# Altium project Gebru.PrjPcb (part 1 of 2)
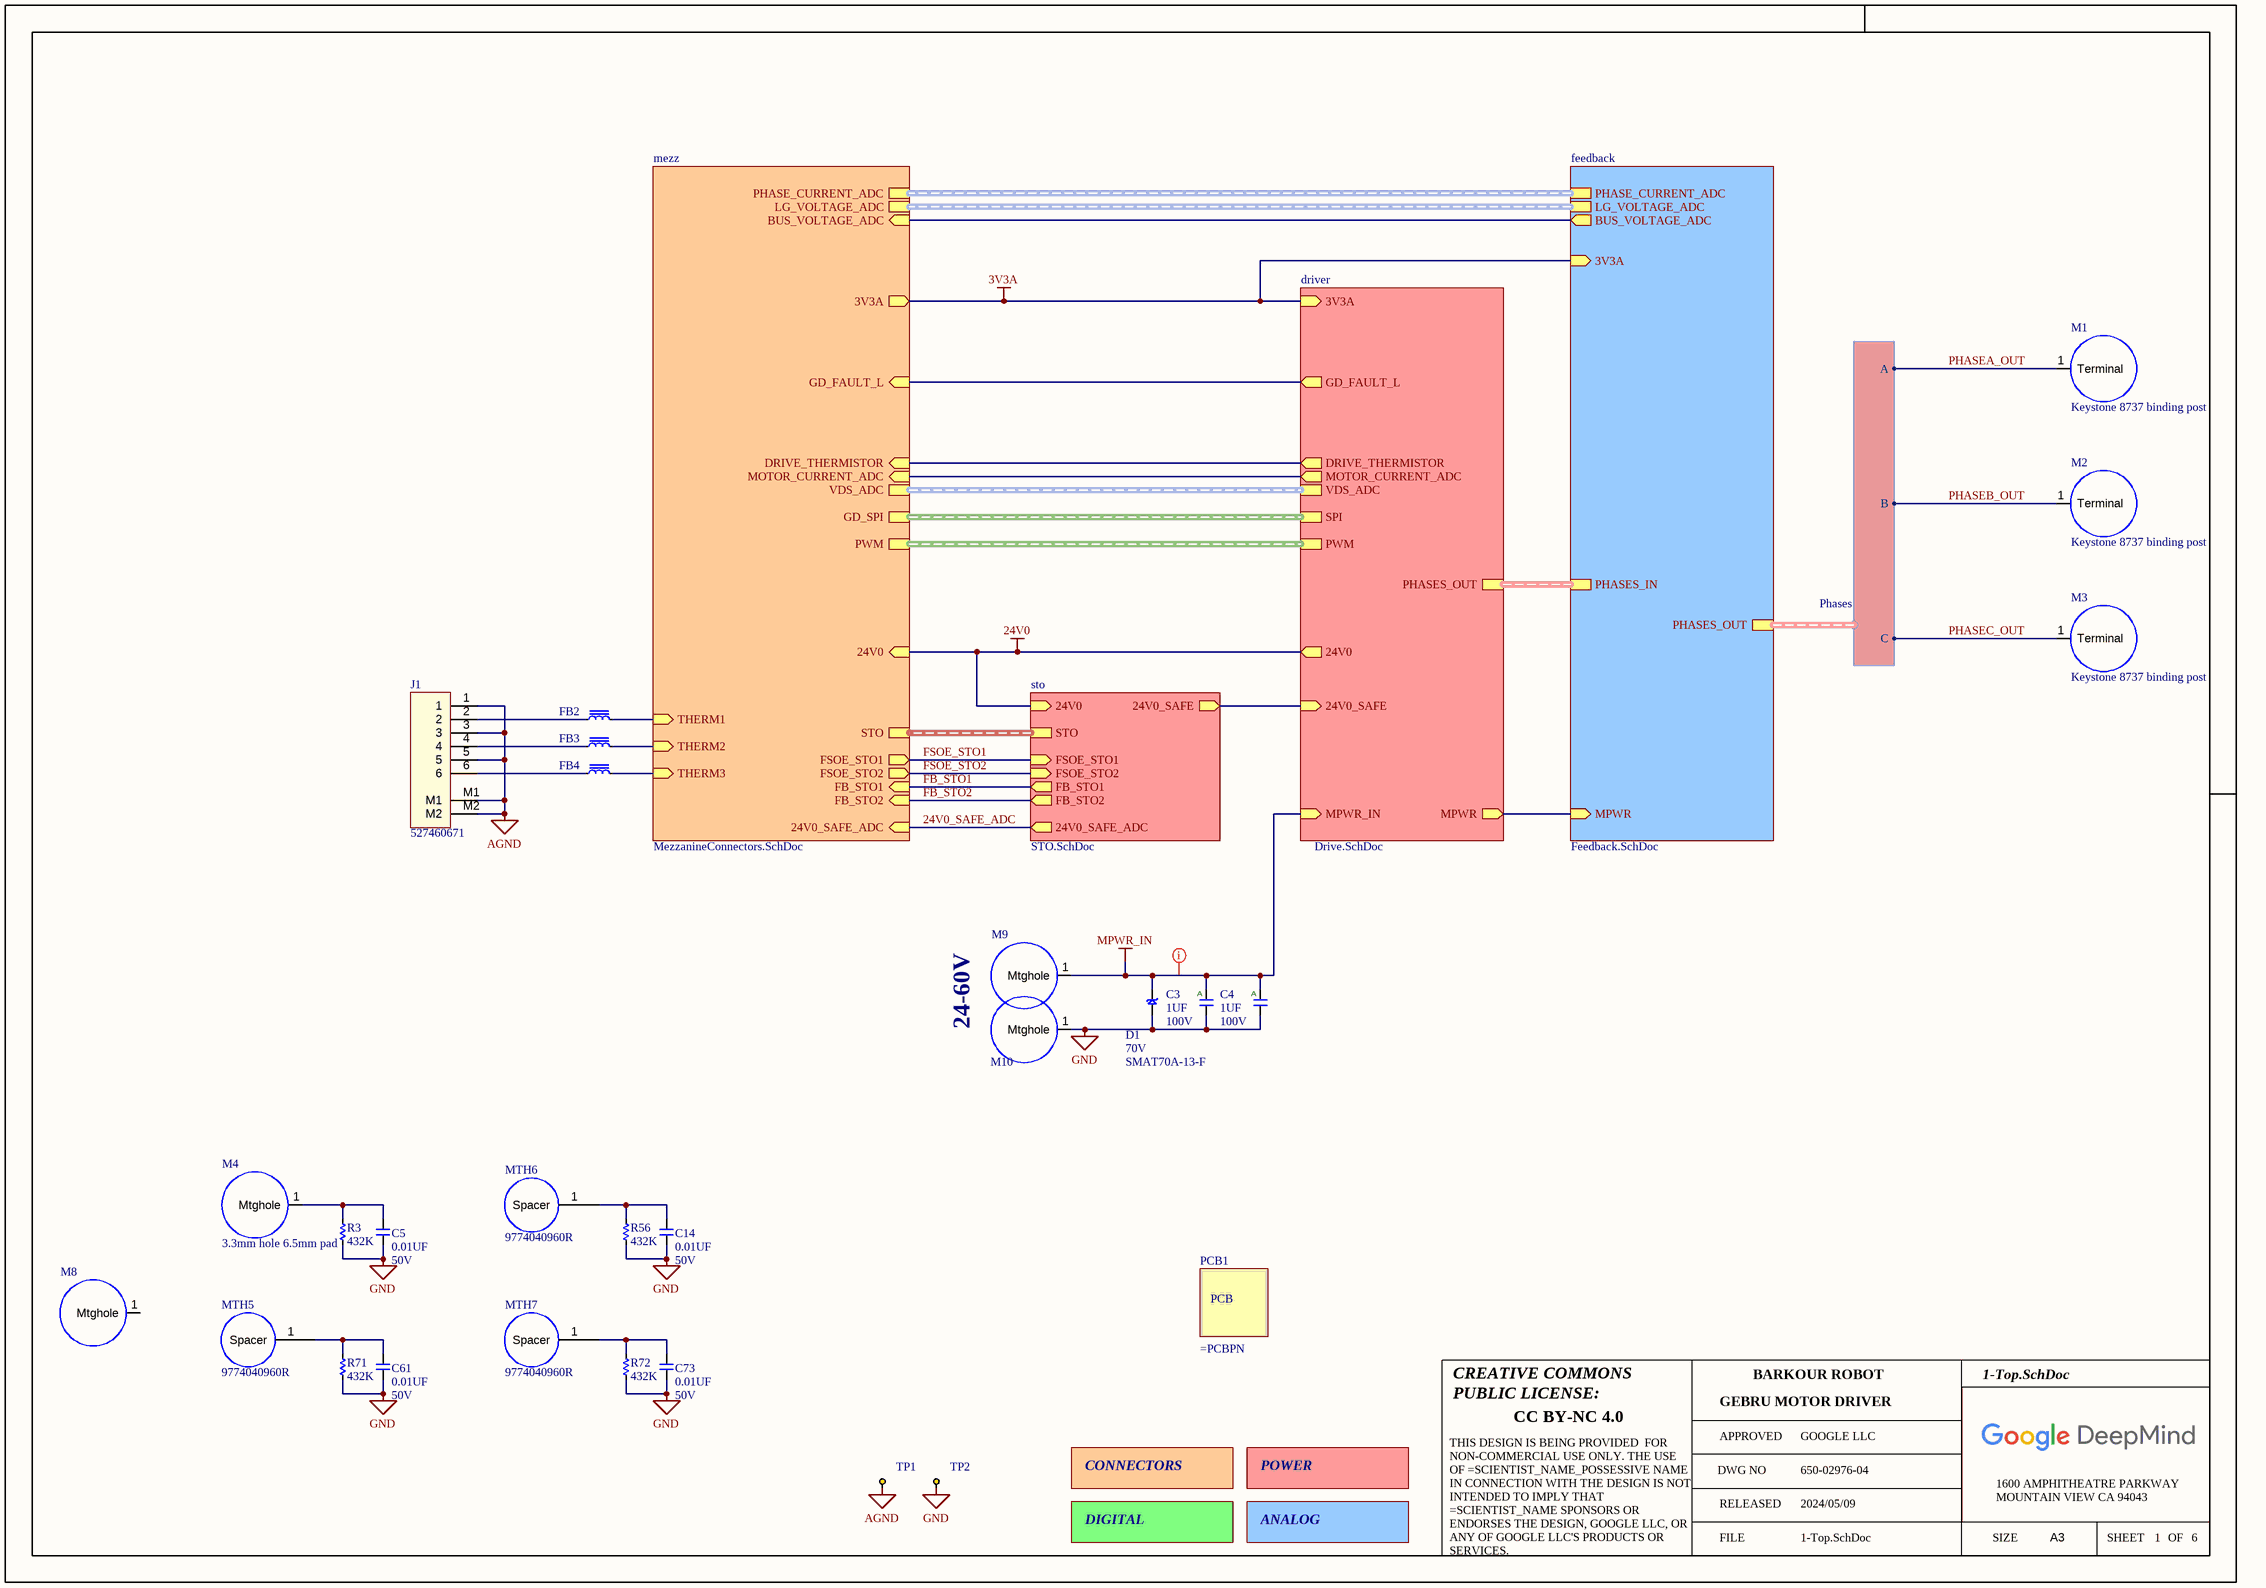
[diagram p0: 1-Top.SchDoc]
Scientist_Name_Possessive: TIMNIT GEBRU'S; Scientist_Name: TIMNIT GEBRU; PROJECT_NAME: GEBRU MOTOR DRIVER; GPN_PCBA: 650-02976-04
6 sheets, 204 parts. Net scope: hierarchical (ports join the sheet entries above them; power ports are global).
Board file: Gebru.PcbDoc
Sheets:
  1-Top.SchDoc
    feedback = Feedback.SchDoc
    driver = Drive.SchDoc
      PHA = HBridge.SchDoc
      PHB = HBridge.SchDoc
      PHC = HBridge.SchDoc
    sto = STO.SchDoc
    mezz = MezzanineConnectors.SchDoc

## Sheet 1-Top.SchDoc
size 420 x 297 mm; DocumentNumber: 1; SheetNumber: 1; SheetTotal: 6; PageSetup: Record=PageOptions|CenterHorizontal=True|CenterVertical=True|PrintScale=0.96|XCorrection=1.00|YCorrection=1.00|PrintKind=1|BorderSize=5000000|LeftOffset=0|BottomOffset=0|Orientation=2|PaperLength=4318|PaperWidth=2794|Scale=100|PaperSource=7|PrintQuality=600|MediaType=1|DitherType=10|PaperKind=11" x 17"|PrintScaleMode=1

### Parts
C3  value 1UF  Voltage: 100V  [C0805]  (hidden comment: __Template_Cap_Auto)
C4  value 1UF  Voltage: 100V  [C0805]  (hidden comment: __Template_Cap_Auto)
C5  value 0.01UF  Voltage: 50V  [C0402]  (hidden comment: __Template_Cap)
C14  value 0.01UF  Voltage: 50V  [C0402]  (hidden comment: __Template_Cap)
C61  value 0.01UF  Voltage: 50V  [C0402]  (hidden comment: __Template_Cap)
C73  value 0.01UF  Voltage: 50V  [C0402]  (hidden comment: __Template_Cap)
D1  value SMAT70A-13-F  Voltage - DC Reverse (VR) (MAX): 70V  [SMA_B130-13-F]  (hidden comment: __Template_Diode_TVS_A/K)
FB2  LAIRD MI0603L221R-10  [INDC160X80X105L30N]  (value not drawn)
FB3  LAIRD MI0603L221R-10  [INDC160X80X105L30N]  (value not drawn)
FB4  LAIRD MI0603L221R-10  [INDC160X80X105L30N]  (value not drawn)
J1  MFG P/N: 527460671  [MOLEX_FPC_527460671]
M1  Keystone 8737 binding post  [Keystone_8737]  (no BOM)
M2  Keystone 8737 binding post  [Keystone_8737]  (no BOM)
M3  Keystone 8737 binding post  [Keystone_8737]  (no BOM)
M4  3.3mm hole 6.5mm pad  [3.3HOLE6.5PAD]  (no BOM)
M8  3.7mm hole 5mm pad  [3.7hole5pad]  (value not drawn)
M9  1.3mm hole 5mm pad  [1.7hole5padSQ]  (value not drawn)  (no BOM)
M10  1.3mm hole 5mm pad  [1.7hole5padRD]  (value not drawn)  (no BOM)
MTH5  9774040960R  [9774040960R]
MTH6  9774040960R  [9774040960R]
MTH7  9774040960R  [9774040960R]
PCB1  (no value)  (mechanical)
R3  value 432K  [R0805]
R56  value 432K  [R0805]
R71  value 432K  [R0805]
R72  value 432K  [R0805]
TP1  TEST_KEYSTONE5001  [TP_KEYSTONE_5001]  (value not drawn)
TP2  TEST_KEYSTONE5001  [TP_KEYSTONE_5001]  (value not drawn)

### Sub-sheets
driver = Drive.SchDoc: PWM (harness PWM), SPI (harness SPI), 24V0 (out), 24V0_SAFE (in), MPWR_IN (in), MOTOR_CURRENT_ADC (out), VDS_ADC (harness Phases), PHASES_OUT (harness Phases), 3V3A (in), GD_FAULT_L (out), DRIVE_THERMISTOR (out), MPWR (out)
feedback = Feedback.SchDoc: PHASE_CURRENT_ADC (harness Phases), PHASES_OUT (harness Phases), PHASES_IN (harness Phases), LG_VOLTAGE_ADC (harness Phases), BUS_VOLTAGE_ADC (out), 3V3A (in), MPWR (in)
mezz = MezzanineConnectors.SchDoc: GD_SPI (harness SPI), PWM (harness PWM), 24V0 (in), 3V3A (out), FB_STO2 (in), FSOE_STO1 (out), FSOE_STO2 (out), FB_STO1 (in), 24V0_SAFE_ADC (in), THERM3 (in), THERM1 (in), THERM2 (in), VDS_ADC (harness Phases), MOTOR_CURRENT_ADC (in), DRIVE_THERMISTOR (in), GD_FAULT_L (in), PHASE_CURRENT_ADC (harness Phases), LG_VOLTAGE_ADC (harness Phases), BUS_VOLTAGE_ADC (in), STO (harness STO)
sto = STO.SchDoc: FB_STO2 (out), FSOE_STO1 (in), FSOE_STO2 (in), FB_STO1 (out), 24V0_SAFE (out), 24V0_SAFE_ADC (out), 24V0 (in), STO (harness STO)

### Harnesses
Phases: A, B, C

### Nets
3V3A: sheet feedback/3V3A, sheet driver/3V3A, sheet mezz/3V3A
24V0: sheet driver/24V0, sheet sto/24V0, sheet mezz/24V0
AGND: J1.1 J1.3 J1.5 J1.M1 J1.M2 TP1.1
GND: C3.2 C4.2 C5.2 C14.2 C61.2 C73.2 D1.A M10.1(Mtghole) R3.1 R56.1 R71.1 R72.1 TP2.1
MPWR: sheet feedback/MPWR, sheet driver/MPWR
MPWR_IN: C3.1 C4.1 D1.K M9.1(Mtghole) ; sheet driver/MPWR_IN
24V0_SAFE: sheet driver/24V0_SAFE, sheet sto/24V0_SAFE
24V0_SAFE_ADC: sheet sto/24V0_SAFE_ADC, sheet mezz/24V0_SAFE_ADC
FB_STO1: sheet sto/FB_STO1, sheet mezz/FB_STO1
FB_STO2: sheet sto/FB_STO2, sheet mezz/FB_STO2
FSOE_STO1: sheet sto/FSOE_STO1, sheet mezz/FSOE_STO1
FSOE_STO2: sheet sto/FSOE_STO2, sheet mezz/FSOE_STO2
GD_FAULT_L: sheet driver/GD_FAULT_L, sheet mezz/GD_FAULT_L
MOTOR_CURRENT_ADC: sheet driver/MOTOR_CURRENT_ADC, sheet mezz/MOTOR_CURRENT_ADC
PHASEA_OUT: M1.1(Terminal) ; sheet feedback/PHASES_OUT.A
PHASEB_OUT: M2.1(Terminal) ; sheet feedback/PHASES_OUT.B
PHASEC_OUT: M3.1(Terminal) ; sheet feedback/PHASES_OUT.C
NetC5_1: C5.1 M4.1(Mtghole) R3.2
NetC14_1: C14.1 MTH6.1(Spacer) R56.2
NetC52_1: sheet feedback/BUS_VOLTAGE_ADC, sheet mezz/BUS_VOLTAGE_ADC
NetC61_1: C61.1 MTH5.1(Spacer) R71.2
NetC73_1: C73.1 MTH7.1(Spacer) R72.2
NetFB2_1: FB2.1 J1.2
NetFB2_2: FB2.2 ; sheet mezz/THERM1
NetFB3_1: FB3.1 J1.4
NetFB3_2: FB3.2 ; sheet mezz/THERM2
NetFB4_1: FB4.1 J1.6
NetFB4_2: FB4.2 ; sheet mezz/THERM3
NetJ5_19: sheet driver/DRIVE_THERMISTOR, sheet mezz/DRIVE_THERMISTOR

Not connected (* = marked no-connect by the designer): M8 1(Mtghole)

### Buses and harness runs
harness sheet driver/PHASES_OUT = sheet feedback/PHASES_IN
harness sheet driver/PWM = sheet mezz/PWM
harness sheet driver/SPI = sheet mezz/GD_SPI
harness sheet driver/VDS_ADC = sheet mezz/VDS_ADC
harness sheet feedback/LG_VOLTAGE_ADC = sheet mezz/LG_VOLTAGE_ADC
harness sheet feedback/PHASE_CURRENT_ADC = sheet mezz/PHASE_CURRENT_ADC
harness sheet mezz/STO = sheet sto/STO

### Layout directives
net class HV: MPWR_IN

### Notes on the sheet
- 24-60V
- CONNECTORS
- POWER
- DIGITAL
- ANALOG
- CREATIVE COMMONS
- PUBLIC LICENSE:
- BARKOUR ROBOT
- CC BY-NC 4.0
- APPROVED
- DWG NO
- GOOGLE LLC
- FILE
- RELEASED
- 2024/05/09
- SIZE
- 1600 AMPHITHEATRE PARKWAY
- MOUNTAIN VIEW CA 94043
- A3
- SHEET
- OF
- THIS DESIGN IS BEING PROVIDED  FOR NON-COMMERCIAL USE ONLY. THE USE OF =SCIENTIST_NAME_POSSESSIVE NAME IN CONNECTION WITH THE DESIGN IS NOT INTENDED TO IMPLY THAT =SCIENTIST_NAME SPONSORS OR ENDORSES THE DESIGN, GOOGLE LLC, OR ANY OF GOOGLE LLC'S PRODUCTS OR SERVICES.
- (in symbol 1093) A

### Library data of the parts
C3 C4 = 1093: CAP, CER, X7S, 1uF, 20%, 100V, 0805; ID: 1093; MFG: TDK; MFG P/N: CGA4J3X7S2A105M125AE; XPN: XS-10001040; COMMON: 150-01093-00; PROXY: 150-03473-00; EES: 150-04579-00; Status: Released; Package: 0805; Dielectric: X7S; Tolerance: 20%; Height: 1.5mm T; ComponentLink1Description: Datasheet; LOON: 150-01093-00; Gecko: 150-01093-00
C5 C14 C61 C73 = 625: CAP, CER, X7R, 0.01uF, 50V, 20%, 0402, 0.56mm T; ID: 625; MFG: KEMET; MFG P/N: C0402C103M5RACTU; XPN: 150-00227-00; EES: 150-04592-00; Status: Released; Package: 0402; Dielectric: X7R; Tolerance: 20%; Height: 0.56mm T; ComponentLink1Description: Datasheet; COMMON: 150-00227-00; LOON: 150-00227-00; Gecko: 150-00227-00
D1 = 200: DIODE, TVS, UNI-DIR, 70VR, 100VCL, 400W, 140PF @1MHZ, SMA; ID: 200; MFG: Diodes Incorporated; PROXY: 480-01326-00; Voltage - Clamping (Max) @ Ipp: 100V; Status: Released; MFG P/N: SMAT70A-13-F; Package: SMA; Category: Diode; RoHS Compliant: Yes; Diode Type: TVS; Mounting Type: SMD; Operating Temperature – Junction: -55°C ~ 150°C (TJ); Supplier 1: Digi-Key; HelpURL: https://www.digikey.in/product-detail/en/diodes-incorporated/SMAT70A-13-F/SMAT70A-FDICT-ND/804910; ComponentLink1Description: Datasheet; ComponentLink1URL: https://www.diodes.com/assets/Datasheets/ds30213.pdf; Supplier Part Number 1: SMAT70A-FDICT-ND
FB2-FB4 = f5bd4cf1-070f-4480-bf1a-f8cba0e78574: FERRITE BEAD 220 OHM 0603 1LN; Manufacturer: Laird Technologies; Grade: Commercial; Value: 220 Ohms @ 100 MHz; Current Rating: 2A; ComponentId: f5bd4cf1-070f-4480-bf1a-f8cba0e78574; Manufacturer Part Number: MI0603L221R-10; Package: Inductor, 0603; ComponentLink1Description: Datasheet; ComponentLink1URL: https://media.digikey.com/pdf/Data%20Sheets/Laird%20Technologies/EMI_Filtering_and_RF_Inductors.pdf; Category: Ferrite Beads; Status: Preliminary; Storage Temperature: -40 °C ~ 125 °C; Operating Temperature: -40 °C ~ 125 °C
J1 = 1210: CONN, FFC, RA, 1x6 P, 0.5MM PITCH, 2.3MM H, GOLD, SMD; ID: 1210; MFG: Molex; Number of Positions: 6; Current Rating: 0.5A; Voltage, Rated: 50V; EES: 210-04996-00; Sub Assy Qty 2: 0; Status: Released; RoHS Compliant: Yes; Connector Type: FFC; Mounting Type: Surface Mount; Orientation: Right Angle; Pitch: 0.5mm; Number of Rows: 1; Features: Contacts, Bottom; Operating Temperature: -20°C ~ 85°C; Supplier 1: Digi-Key; HelpURL: https://www.digikey.com/en/products/detail/molex/0527460671/2074148?s=N4IgTCBcDaIKxgOwBYBsAGViCMIC6AvkA; ComponentLink1Description: Datasheet; ComponentLink1URL: https://www.molex.com/pdm_docs/sd/527460671_sd.pdf; Height: 2.3mm; Supplier Part Number 1: WM7977TR-ND; Sub Assy Qty 3: 0; Sub Assy Qty 4: 0
M1-M3 = Keystone_8737_post: 1.5mm hole 5.6mm pad
M4 = MtgHole_2
M8 = MtgHole
M9 M10 = MtgHole_1
MTH5-MTH7 = Wurth_4mm_Spacer_9774040960R: Spacer Material: Steel Mounting: SMT Series: WA-SMST For ø: 3.3 mm; Manufacturer: Wurth Electronics; Plating: Tin; Threaded/Unthreaded: Unthreaded; Inside Diameter: 0.13inch; Outside Diameter: 0.236inch; Supplier 1: Digi-Key; Manufacturer Part Number: 9774040960R; RoHS: Yes; Category: Spacers, Standoffs; Stock 1: 190; Pricing 1: 1=1.79000, 10=1.71600, 50=1.50700, 100=1.40200 (USD); Material: Steel; Length: 0.213inch; REACH SVHC: Unknown; ComponentLink1URL: http://www.farnell.com/datasheets/1960394.pdf?src-supplier=Farnell; ComponentLink1Description: http://www.farnell.com/datasheets/1960394.pdf?src-supplier=Farnell; ComponentLink2URL: http://www.mouser.com/ds/2/445/9774040960R-611108.pdf?src-supplier=Mouser; ComponentLink2Description: http://www.mouser.com/ds/2/445/9774040960R-611108.pdf?src-supplier=Mouser; ComponentLink3URL: https://media.digikey.com/pdf/Data%20Sheets/Wurth%20Electronics%20PDFs/WA-SMSx_Performance_Flyer.pdf?src-supplier=Digi-Key; ComponentLink3Description: https://media.digikey.com/pdf/Data%20Sheets/Wurth%20Electronics%20PDFs/WA-SMSx_Performance_Flyer.pdf?src-supplier=Digi-Key; ComponentLink4URL: http://www.farnell.com/datasheets/1960394.pdf?src-supplier=Element14; ComponentLink4Description: http://www.farnell.com/datasheets/1960394.pdf?src-supplier=Element14; ComponentLink5URL: http://www.farnell.com/datasheets/1960394.pdf?src-supplier=Newark; ComponentLink5Description: http://www.farnell.com/datasheets/1960394.pdf?src-supplier=Newark; Supplier Part Number 1: 732-7092-1-ND
PCB1 = 110: PCB; ID: 110; Level: 1; FindNumber: 010; Org: ORG - REP; Type: PCB; GPN: =GPN_PCB; Status: In Development; MFG P/N: =PCBPN; PROXY: =PCBPN; Type: 651-PCB; ItemNumber: =PCBPN; ProductLine: Proxy
R3 R56 R71 R72 = 5492: Resistor, 432K Ohms, 0805, 0.125W, ±1%; ID: 5492; MFG: YAGEO; MFG P/N: RC0805FR-07432KL; Power: 1/8W; COMMON: 470-08723-00; XPN: XS-10019230; Status: Released; Package: 0805; Tolerance: 1%; Height: 0.60mm; Supplier 1: Digi-Key; LOON: 470-08723-00; Gecko: 470-08723-00; Supplier Part Number 1: 311-432KCRCT-ND
TP1 TP2 = TEST_KEYSTONE5001: PC TEST POINT TH RING; Manufacturer: Keystone Electronics; Manufacturer Part Number: 5001; Part Number: 250-00184-00; Supplier 1: Digi-Key; Supplier Part Number 1: 5001K-ND; RoHS: RoHS Compliant; Category: Test and Measurement; Stock 1: 341830; Pricing 1: 1=0.33, 10=0.309, 50=0.2252, 100=0.2164, 250=0.19432, 500=0.18548, 1000=0.15456, 2500=0.14131, 5000=0.13248 (USD); Packaging: Bulk; Type: PC Test Point, Miniature; Terminal: 0.010" x 0.020" (0.25mm x 0.51mm) Phosphor Bronze Wire, Silver Plate; Mounting Type: 0.040" (1.02mm) Hole Diameter; Material: Base, Nylon 46, UL 94V-0; Color: Black; ComponentLink1URL: http://www.keyelco.com/product-pdf.cfm?p=1310; ComponentLink1Description: http://www.keyelco.com/product-pdf.cfm?p=1310

## Sheet Feedback.SchDoc
size 420 x 297 mm; DocumentNumber: 5; SheetNumber: 6; SheetTotal: 6; PageSetup: Record=PageOptions|CenterHorizontal=True|CenterVertical=True|PrintScale=0.96|XCorrection=1.00|YCorrection=1.00|PrintKind=1|BorderSize=5000000|LeftOffset=0|BottomOffset=0|Orientation=2|PaperLength=4318|PaperWidth=2794|Scale=100|PaperSource=7|PrintQuality=600|MediaType=1|DitherType=10|PaperKind=11" x 17"|PrintScaleMode=1
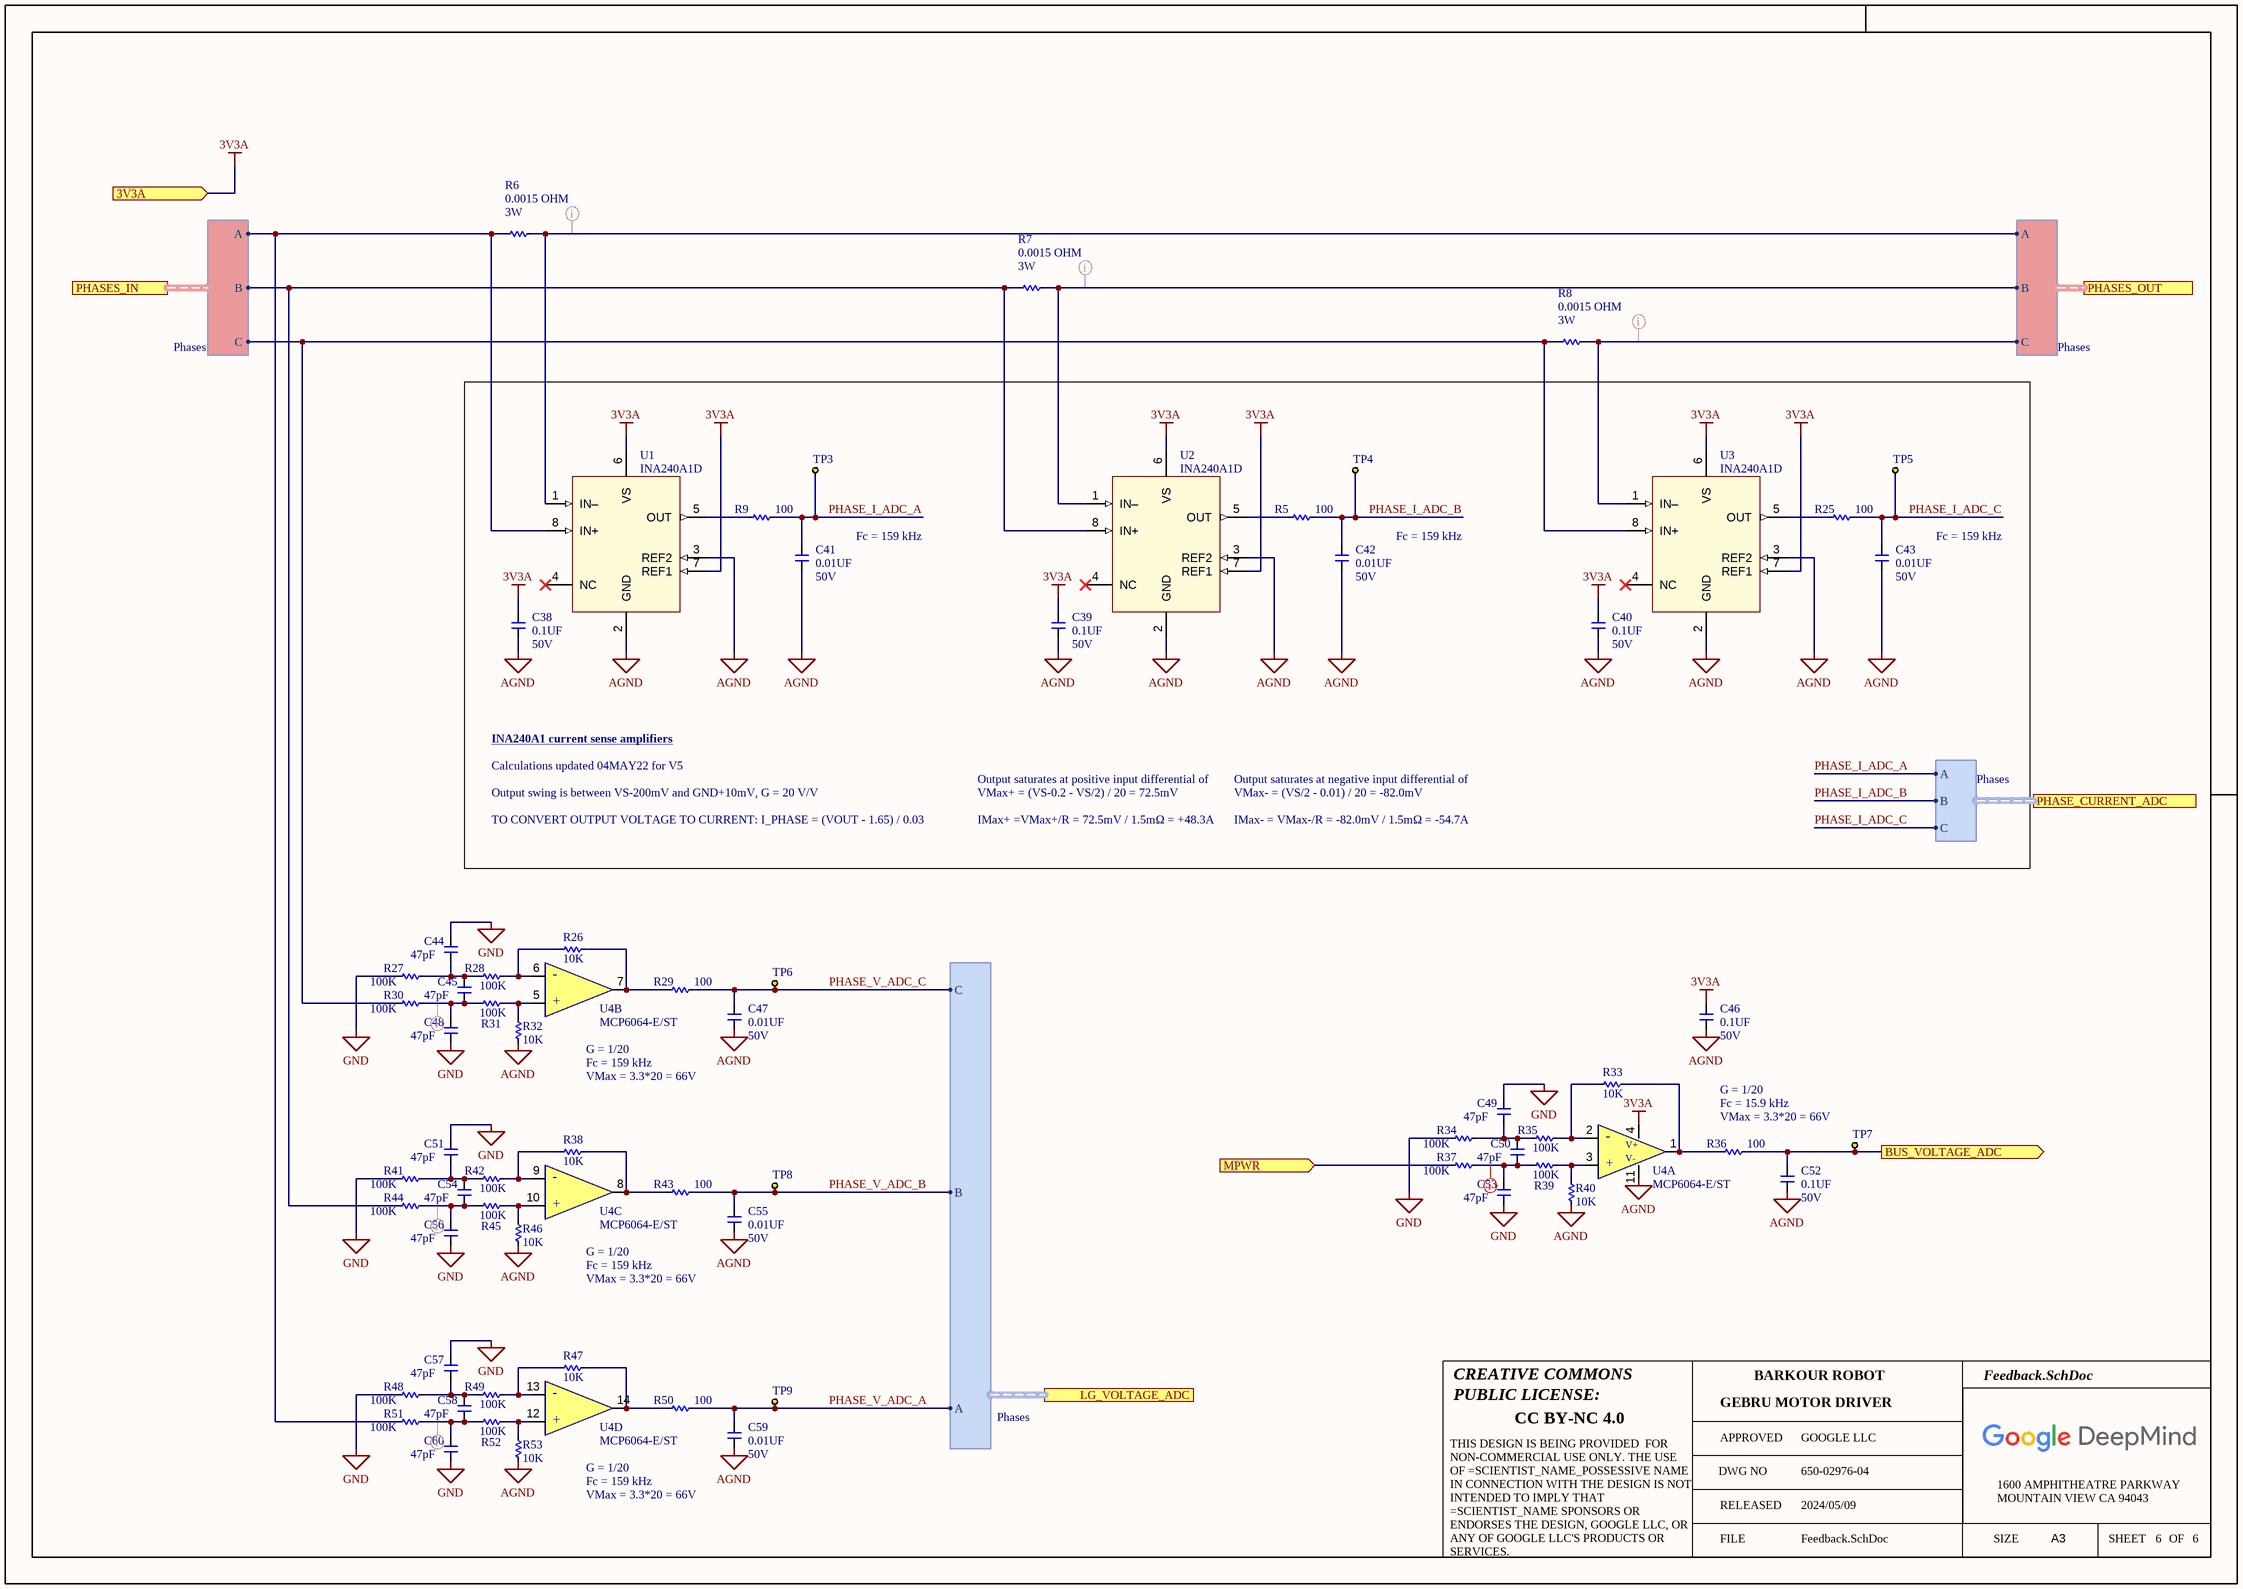
[diagram p1: Feedback.SchDoc]

### Parts
C38  value 0.1UF  Voltage: 50V  [C0402]  (hidden comment: __Template_Cap)
C39  value 0.1UF  Voltage: 50V  [C0402]  (hidden comment: __Template_Cap)
C40  value 0.1UF  Voltage: 50V  [C0402]  (hidden comment: __Template_Cap)
C41  value 0.01UF  Voltage: 50V  [C0402]  (hidden comment: __Template_Cap)
C42  value 0.01UF  Voltage: 50V  [C0402]  (hidden comment: __Template_Cap)
C43  value 0.01UF  Voltage: 50V  [C0402]  (hidden comment: __Template_Cap)
C44  value 47pF  [C0402]  (hidden comment: __Template_Cap)
C45  value 47pF  [C0402]  (hidden comment: __Template_Cap)
C46  value 0.1UF  Voltage: 50V  [C0402]  (hidden comment: __Template_Cap)
C47  value 0.01UF  Voltage: 50V  [C0402]  (hidden comment: __Template_Cap)
C48  value 47pF  [C0402]  (hidden comment: __Template_Cap)
C49  value 47pF  [C0402]  (hidden comment: __Template_Cap)
C50  value 47pF  [C0402]  (hidden comment: __Template_Cap)
C51  value 47pF  [C0402]  (hidden comment: __Template_Cap)
C52  value 0.1UF  Voltage: 50V  [C0402]  (hidden comment: __Template_Cap)
C53  value 47pF  [C0402]  (hidden comment: __Template_Cap)
C54  value 47pF  [C0402]  (hidden comment: __Template_Cap)
C55  value 0.01UF  Voltage: 50V  [C0402]  (hidden comment: __Template_Cap)
C56  value 47pF  [C0402]  (hidden comment: __Template_Cap)
C57  value 47pF  [C0402]  (hidden comment: __Template_Cap)
C58  value 47pF  [C0402]  (hidden comment: __Template_Cap)
C59  value 0.01UF  Voltage: 50V  [C0402]  (hidden comment: __Template_Cap)
C60  value 47pF  [C0402]  (hidden comment: __Template_Cap)
R5  value 100  [RES 0402_1005 RF]
R6  value 0.0015 OHM  Power: 3W  [R2512_H0.8MM]
R7  value 0.0015 OHM  Power: 3W  [R2512_H0.8MM]
R8  value 0.0015 OHM  Power: 3W  [R2512_H0.8MM]
R9  value 100  [R0402]
R25  value 100  [R0402]
R26  value 10K  [R0402]
R27  value 100K  [R0603]
R28  value 100K  [R0603]
R29  value 100  [R0402]
R30  value 100K  [R0603]
R31  value 100K  [R0603]
R32  value 10K  [R0402]
R33  value 10K  [R0402]
R34  value 100K  [R0603]
R35  value 100K  [R0603]
R36  value 100  [R0402]
R37  value 100K  [R0603]
R38  value 10K  [R0402]
R39  value 100K  [R0603]
R40  value 10K  [R0402]
R41  value 100K  [R0603]
R42  value 100K  [R0603]
R43  value 100  [R0402]
R44  value 100K  [R0603]
R45  value 100K  [R0603]
R46  value 10K  [R0402]
R47  value 10K  [R0402]
R48  value 100K  [R0603]
R49  value 100K  [R0603]
R50  value 100  [R0402]
R51  value 100K  [R0603]
R52  value 100K  [R0603]
R53  value 10K  [R0402]
TP3  TEST_KEYSTONE5015  [TP_KEYSTONE_5015]  (value not drawn)
TP4  TEST_KEYSTONE5015  [TP_KEYSTONE_5015]  (value not drawn)
TP5  TEST_KEYSTONE5015  [TP_KEYSTONE_5015]  (value not drawn)
TP6  TEST_KEYSTONE5015  [TP_KEYSTONE_5015]  (value not drawn)
TP7  TEST_KEYSTONE5015  [TP_KEYSTONE_5015]  (value not drawn)
TP8  TEST_KEYSTONE5015  [TP_KEYSTONE_5015]  (value not drawn)
TP9  TEST_KEYSTONE5015  [TP_KEYSTONE_5015]  (value not drawn)
U1  INA240A1D  [TI SOIC-8 D0008A]
U2  INA240A1D  [TI SOIC-8 D0008A]
U3  INA240A1D  [TI SOIC-8 D0008A]
U4  Manufacturer Part Number: MCP6064-E/ST  [14TSSOP65]  (hidden comment: MCP6064)  (parts A,B,C,D of 4)

### Ports
3V3A (in), BUS_VOLTAGE_ADC (out), LG_VOLTAGE_ADC (harness Phases), MPWR (in), PHASE_CURRENT_ADC (harness Phases), PHASES_IN (harness Phases), PHASES_OUT (harness Phases)

### Harnesses
Phases: A, B, C

### Nets
3V3A: C38.1 C39.1 C40.1 C46.1 U1.6(VS) U1.7(REF1) U2.6(VS) U2.7(REF1) U3.6(VS) U3.7(REF1) U4.4 ; port 3V3A
AGND: C38.2 C39.2 C40.2 C41.2 C42.2 C43.2 C46.2 C47.2 C52.2 C55.2 C59.2 R32.1 R40.1 R46.1 R53.1 U1.2(GND) U1.3(REF2) U2.2(GND) U2.3(REF2) U3.2(GND) U3.3(REF2) U4.11
GND: C44.2 C48.1 C49.2 C51.2 C53.1 C56.1 C57.2 C60.1 R27.1 R34.1 R41.1 R48.1
MPWR: R37.1 ; port MPWR
PHASE_I_ADC_A: C41.1 R9.2 TP3.1 ; port PHASE_CURRENT_ADC.A
PHASE_I_ADC_B: C42.1 R5.2 TP4.1 ; port PHASE_CURRENT_ADC.B
PHASE_I_ADC_C: C43.1 R25.2 TP5.1 ; port PHASE_CURRENT_ADC.C
PHASE_V_ADC_A: C59.1 R50.2 TP9.1 ; port LG_VOLTAGE_ADC.A
PHASE_V_ADC_B: C55.1 R43.2 TP8.1 ; port LG_VOLTAGE_ADC.B
PHASE_V_ADC_C: C47.1 R29.2 TP6.1 ; port LG_VOLTAGE_ADC.C
PHASEA: R6.1 R51.1 U1.8(IN+) ; port PHASES_IN.A
PHASEA_OUT: R6.2 U1.1(IN–) ; port PHASES_OUT.A
PHASEB: R7.1 R44.1 U2.8(IN+) ; port PHASES_IN.B
PHASEB_OUT: R7.2 U2.1(IN–) ; port PHASES_OUT.B
PHASEC: R8.1 R30.1 U3.8(IN+) ; port PHASES_IN.C
PHASEC_OUT: R8.2 U3.1(IN–) ; port PHASES_OUT.C
NetC44_1: C44.1 C45.2 R27.2 R28.1
NetC45_1: C45.1 C48.2 R30.2 R31.1
NetC49_1: C49.1 C50.2 R34.2 R35.1
NetC50_1: C50.1 C53.2 R37.2 R39.1
NetC51_1: C51.1 C54.2 R41.2 R42.1
NetC52_1: C52.1 R36.2 TP7.1 ; port BUS_VOLTAGE_ADC
NetC54_1: C54.1 C56.2 R44.2 R45.1
NetC57_1: C57.1 C58.2 R48.2 R49.1
NetC58_1: C58.1 C60.2 R51.2 R52.1
NetR5_1: R5.1 U2.5(OUT)
NetR9_1: R9.1 U1.5(OUT)
NetR25_1: R25.1 U3.5(OUT)
NetR26_1: R26.1 R29.1 U4.7
NetR26_2: R26.2 R28.2 U4.6
NetR31_2: R31.2 R32.2 U4.5
NetR33_1: R33.1 R36.1 U4.1
NetR33_2: R33.2 R35.2 U4.2
NetR38_1: R38.1 R43.1 U4.8
NetR38_2: R38.2 R42.2 U4.9
NetR39_2: R39.2 R40.2 U4.3
NetR45_2: R45.2 R46.2 U4.10
NetR47_1: R47.1 R50.1 U4.14
NetR47_2: R47.2 R49.2 U4.13
NetR52_2: R52.2 R53.2 U4.12

Not connected (* = marked no-connect by the designer): U1 4(NC)*; U2 4(NC)*; U3 4(NC)*

### Layout directives
net class HVSW: NetC45_1, NetC54_1, NetC58_1, PHASEA_OUT, PHASEB_OUT, PHASEC_OUT
net class HV: NetC50_1

### Notes on the sheet
- Fc = 159 kHz
- Output swing is between VS-200mV and GND+10mV, G = 20 V/V
- INA240A1 current sense amplifiers <https://www.ti.com/lit/ds/symlink/ina240.pdf>
- Calculations updated 04MAY22 for V5
- VMax+ = (VS-0.2 - VS/2) / 20 = 72.5mV
- Output saturates at positive input differential of
- VMax- = (VS/2 - 0.01) / 20 = -82.0mV
- Output saturates at negative input differential of
- TO CONVERT OUTPUT VOLTAGE TO CURRENT: I_PHASE = (VOUT - 1.65) / 0.03
- IMax+ =VMax+/R = 72.5mV / 1.5mΩ = +48.3A
- IMax- = VMax-/R = -82.0mV / 1.5mΩ = -54.7A
- (near U4) G = 1/20
- VMax = 3.3*20 = 66V
- Fc = 15.9 kHz
- G = 1/20
- CREATIVE COMMONS
- PUBLIC LICENSE:
- BARKOUR ROBOT
- CC BY-NC 4.0
- APPROVED
- DWG NO
- GOOGLE LLC
- FILE
- RELEASED
- 2024/05/09
- SIZE
- 1600 AMPHITHEATRE PARKWAY
- MOUNTAIN VIEW CA 94043
- A3
- SHEET
- OF
- THIS DESIGN IS BEING PROVIDED  FOR NON-COMMERCIAL USE ONLY. THE USE OF =SCIENTIST_NAME_POSSESSIVE NAME IN CONNECTION WITH THE DESIGN IS NOT INTENDED TO IMPLY THAT =SCIENTIST_NAME SPONSORS OR ENDORSES THE DESIGN, GOOGLE LLC, OR ANY OF GOOGLE LLC'S PRODUCTS OR SERVICES.
- (in symbol MICROCHIP_MCP6064, part A) -; V+; V-; +
- (in symbol MICROCHIP_MCP6064, part B) -; +
- (in symbol MICROCHIP_MCP6064, part C) -; +
- (in symbol MICROCHIP_MCP6064, part D) -; +

### Library data of the parts
C38-C40 C46 C52 = 1762: CAP, CER, X5R, 0.1uF, 10%, 50V, 0402, 0.55mm; ID: 1762; MFG: YAGEO; MFG P/N: CC0402KRX5R9BB104; EPIC: G150-02449-00; EES: 150-04581-00; Status: Released; Package: 0402; Dielectric: X5R; Tolerance: 10%; Height: 0.55mm; Supplier 1: Digi-Key; HelpURL: https://www.digikey.com/product-detail/en/yageo/CC0402KRX5R9BB104/311-3342-1-ND/6818312; ComponentLink1Description: Datasheet; ComponentLink1URL: http://www.yageo.com/documents/recent/UPY-GPHC_X5R_4V-to-50V_25.pdf; Supplier Part Number 1: 311-3342-1-ND
C41-C43 C47 C55 C59 = 625: as C5 on sheet 1-Top; Status: Released; Package: 0402; Dielectric: X7R; Tolerance: 20%; Height: 0.56mm T; ComponentLink1Description: Datasheet; COMMON: 150-00227-00; LOON: 150-00227-00; Gecko: 150-00227-00
C44 C45 C48-C51 C53 C54 C56-C58 C60 = 1447: CAP, CER, C0G, 47PF, 5%, 50V, 0402; ID: 1447; MFG: TDK; MFG P/N: C1005C0G1H470J050BA; Dielectric: NP0; XPN: 150-00181-00; PROXY: 150-03463-00; Status: NRND; Package: 0402; Voltage: 50V; Tolerance: 5%; Height: 0.56mm T; ComponentLink1Description: Datasheet; COMMON: 150-00181-00
R5 R9 R25 R29 R36 R43 R50 = 7286: RES, 100, 1%, 1/10W, 0402, AUTO GRADE; ID: 7286; MFG: PANASONIC; MFG P/N: ERJ2RKF1000X; COMMON: 470-00294-00; PROXY: Use ID #8481; Status: Released; Package: 0402; Power: 1/10W; Tolerance: 1%; XPN: 470-00294-00
R6-R8 = 9999: RES, 0.0015, 1%, 3W, 2512; ID: 9999; MFG: TE Connectivity Passive Product; MFG P/N: TLR3A30DR0015FTDG; Catagory: Chip Resistor - Surface Mount; EES: 470-17948-00; Status: Released; Package: 2512; Tolerance: 1%; Height: 0.8mm; Supplier 1: Digi-Key; HelpURL: https://www.digikey.com/product-detail/en/te-connectivity-passive-product/TLR3A30DR0015FTDG/A131795CT-ND/8603925; ComponentLink1Description: Datasheet; ComponentLink1URL: https://www.te.com/commerce/DocumentDelivery/DDEController?Action=srchrtrv&DocNm=1773449-3&DocType=DS&DocLang=English; Supplier Part Number 1: A131795CT-ND
R26 R32 R33 R38 R40 R46 R47 R53 = 7216: RES, 10K, 1%, 1/10W, 0402, AUTOGRADE; ID: 7216; MFG: PANASONIC; MFG P/N: ERJ2RKF1002X; COMMON: 470-00319-00; Gecko: 470-17736-00; Status: Released; Package: 0402; Power: 1/10W; Tolerance: 1%; XPN: 470-00319-00
R27 R28 R30 R31 R34 R35 R37 R39 R41 R42 R44 R45 R48 R49 R51 R52 = 6516: RES, 100K, 1%, 1/10W, 0603, AUTO GRADE; ID: 6516; MFG: PANASONIC; MFG P/N: ERJ3EKF1003V; COMMON: 470-00120-00; PROXY: Use ID #8458; Status: Released; Package: 0603; Power: 1/10W; Tolerance: 1%; XPN: 470-00120-00
TP3-TP9 = TEST_KEYSTONE5015: PC TEST POINT MINIATURE SMT; Manufacturer: Keystone Electronics; Manufacturer Part Number: 5015; Part Number: 250-00207-00; Supplier 1: Digi-Key; RoHS: RoHS Compliant; Category: Test and Measurement; Stock 1: 1322985; Pricing 1: 1=0.44, 10=0.413, 50=0.301, 100=0.2891, 250=0.25964, 500=0.24784 (USD); Type: PC Test Point, Miniature; Terminal: 0.010" (0.25mm) Phosphor Bronze, Silver Plate; Mounting Type: Surface Mount; Material: Phosphor Bronze; Color: -; Packaging: Cut Tape (CT); ComponentLink1URL: http://mail.keyelco.com/ENG._DEPT/PDF%20CAT%20NO%20Drawings/5015.pdf; ComponentLink1Description: Datasheet; Supplier Part Number 1: 5015KCT-ND
U1-U3 = INA240A1: Current Sense Amplifiers -4 to 80V, bidirectional, ultra-precise current sense amplifier with enhanced PWM rejection, 20V/V gain; Manufacturer: Texas Instruments; Manufacturer Part Number: INA240A1D; Supplier 1: Digi-Key; Supplier 2: Mouser; Supplier 3: Farnell; Supplier Part Number 1: 296-51172-1-ND; Supplier Part Number 2: 595-INA240A1D; Supplier Part Number 3: 3005359
U4 = MICROCHIP_MCP6064: Microchip MCP6064-E/ST; Quad Op Amp; 0.73MHz CMOS; Rail to Rail; 3V; 5V; 14-Pin TSSOP; Min Supply Voltage: 1.8V; Max Supply Voltage: 6V; Voltage Gain: 115dB; Common Mode Rejection Ratio: 72dB; Gain Bandwidth Product: 730kHz; Number of Channels: 4; Output Current: 27mA; Slew Rate: 0.25V/µs; Nominal Supply Current: 60uA; Input Bias Current: 100pA; Input Offset Voltage (Vos): 150uV; Power Supply Rejection Ratio (PSRR): 70dB; Amplifier Type: GENERAL PURPOSE; ComponentLink1URL: http://www.microchip.com/mymicrochip/filehandler.aspx?ddocname=en528763; ComponentLink1Description: http://www.microchip.com/mymicrochip/filehandler.aspx?ddocname=en528763; Supplier 1: Digi-Key; Supplier Part Number 1: MCP6064-E/ST-ND; Manufacturer: Microchip; RoHS: Yes; Category: Amplifiers - Op Amps, Buffer, Instrumentation; Stock 1: 117; Pricing 1: 1=1.83000, 25=1.52640, 100=1.42500 (USD); Mount: Surface Mount; Case/Package: TSSOP; Number of Pins: 14; Min Operating Temperature: -40°C; Max Operating Temperature: 125°C; Package Quantity: 96; Packaging: Rail/Tube; Bandwidth: 730kHz; Unity Gain Bandwidth Product: 730kHz; Number of Circuits: 4; Operating Supply Current: 60uA; Output Current per Channel: 27mA; Number of Elements: 4; Number of Amplifiers: 4; Supply Current: 60uA; Technology: CMOS; Input Offset Voltage-Max: 150uV; Slew Rate-Nom: 0.25V/µs; Length: 5mm; Width: 4.4mm; Height: 1mm; Radiation Hardening: No; REACH SVHC: No SVHC; Lead Free: Lead Free; RoHS Compliant: Yes; ComponentLink2URL: https://datasheet.ciiva.com/8078/mcp6061-ds22189b-8078832.pdf?src-supplier=Element14; ComponentLink2Description: https://datasheet.ciiva.com/8078/mcp6061-ds22189b-8078832.pdf?src-supplier=Element14; ComponentLink3URL: https://datasheet.ciiva.com/1802/mcp6061-ds22189b-1802877.pdf?src-supplier=Digi-Key; ComponentLink3Description: https://datasheet.ciiva.com/1802/mcp6061-ds22189b-1802877.pdf?src-supplier=Digi-Key; ComponentLink4URL: https://datasheet.ciiva.com/11707/jp542225-11707116.pdf?src-supplier=Avnet; ComponentLink4Description: https://datasheet.ciiva.com/11707/jp542225-11707116.pdf?src-supplier=Avnet; ComponentLink5URL: https://datasheet.ciiva.com/5777/1062687-5777669.pdf?src-supplier=Farnell; ComponentLink5Description: https://datasheet.ciiva.com/5777/1062687-5777669.pdf?src-supplier=Farnell; ComponentLink6URL: https://datasheet.ciiva.com/16348/filehandler-aspxddocname-en542225-16348939.pdf?src-supplier=Future+Electronics; ComponentLink6Description: https://datasheet.ciiva.com/16348/filehandler-aspxddocname-en542225-16348939.pdf?src-supplier=Future+Electronics

## Sheet Drive.SchDoc
size 420 x 297 mm; DocumentNumber: 2; SheetNumber: 2; SheetTotal: 6; PageSetup: Record=PageOptions|CenterHorizontal=True|CenterVertical=True|PrintScale=0.96|XCorrection=1.00|YCorrection=1.00|PrintKind=1|BorderSize=5000000|LeftOffset=0|BottomOffset=0|Orientation=2|PaperLength=4318|PaperWidth=2794|Scale=100|PaperSource=7|PrintQuality=600|MediaType=1|DitherType=10|PaperKind=11" x 17"|PrintScaleMode=1
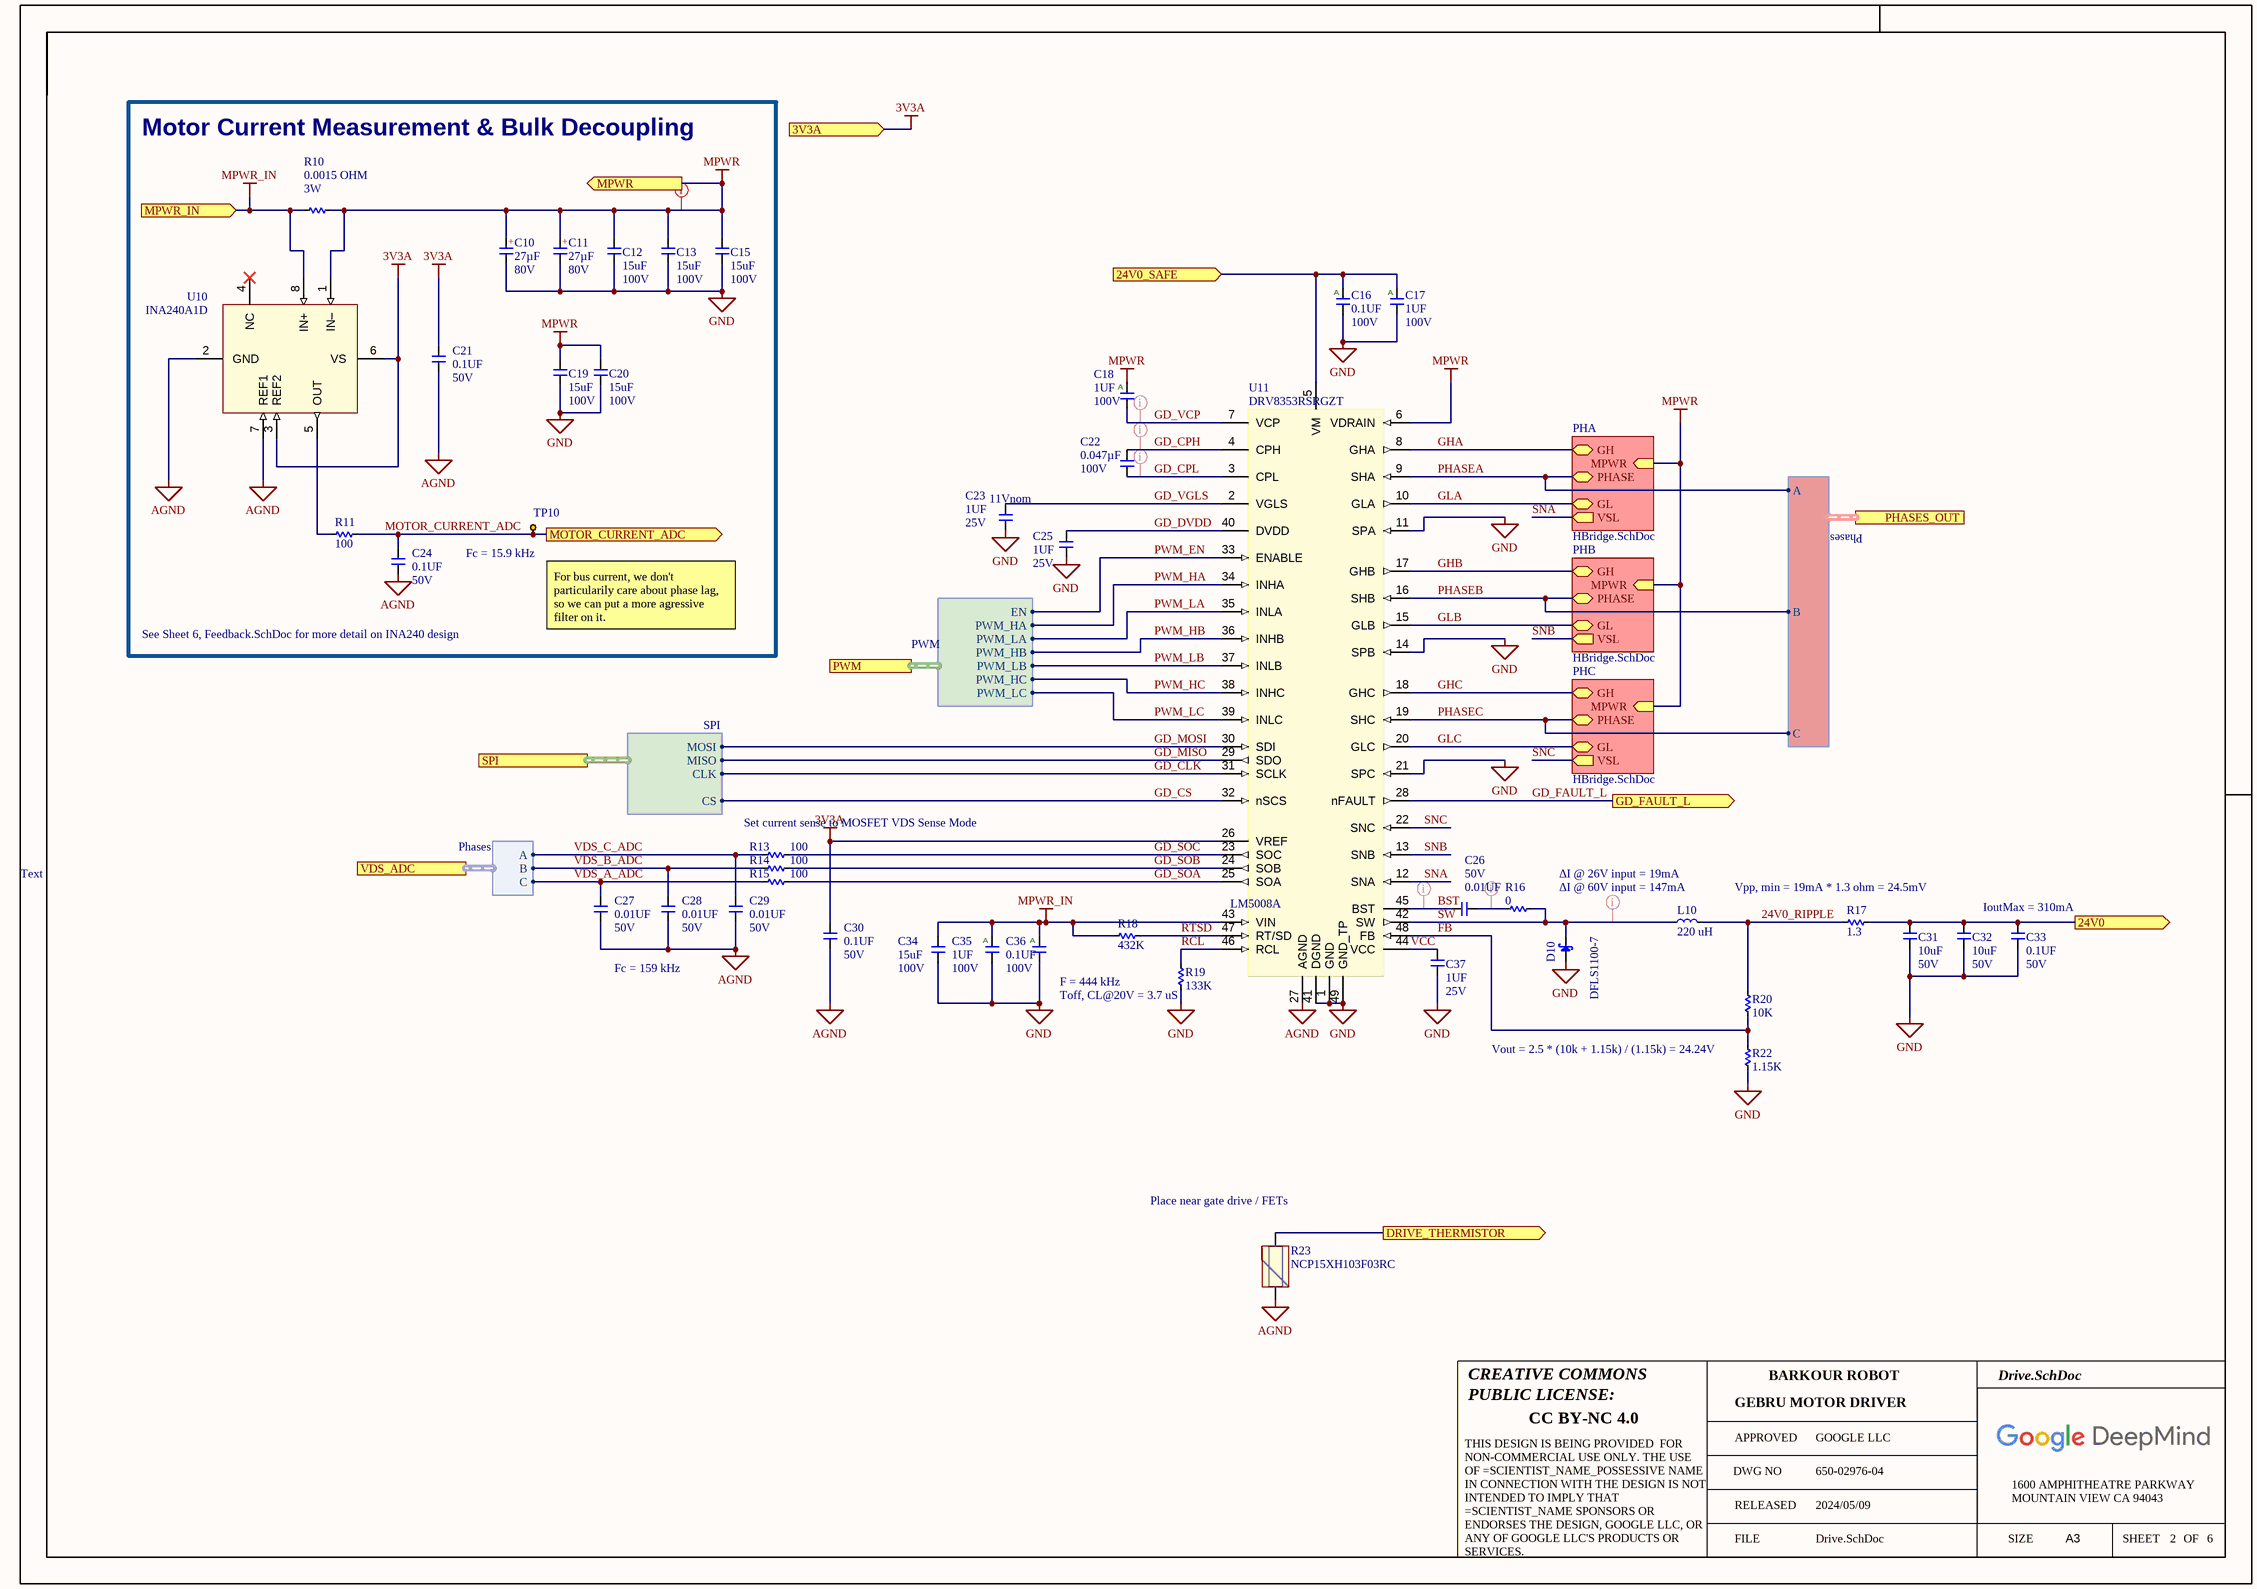
[diagram p2: Drive.SchDoc]

### Parts
C10  value 27µF  Voltage Rating: 80V  [WURTH_WCAP-PTHR_10x12.5x5]  (hidden comment: WURTH 870056175004)
C11  value 27µF  Voltage Rating: 80V  [WURTH_WCAP-PTHR_10x12.5x5]  (hidden comment: WURTH 870056175004)
C12  value 15uF  Voltage: 100V  [C2220]  (hidden comment: __Template_Cap)
C13  value 15uF  Voltage: 100V  [C2220]  (hidden comment: __Template_Cap)
C15  value 15uF  Voltage: 100V  [C2220]  (hidden comment: __Template_Cap)
C16  value 0.1UF  Voltage: 100V  [C0603]  (hidden comment: __Template_Cap_Auto)
C17  value 1UF  Voltage: 100V  [C0805]  (hidden comment: __Template_Cap_Auto)
C18  value 1UF  Voltage: 100V  [C0805]  (hidden comment: __Template_Cap_Auto)
C19  value 15uF  Voltage: 100V  [C2220]  (hidden comment: __Template_Cap)
C20  value 15uF  Voltage: 100V  [C2220]  (hidden comment: __Template_Cap)
C21  value 0.1UF  Voltage: 50V  [C0402]  (hidden comment: __Template_Cap)
C22  value 0.047µF  Voltage: 100V  [C0603Y]  (hidden comment: __Template_Cap)
C23  value 1UF  Voltage: 25V  [C0402]  (hidden comment: __Template_Cap)
C24  value 0.1UF  Voltage: 50V  [C0402]  (hidden comment: __Template_Cap)
C25  value 1UF  Voltage: 25V  [C0402]  (hidden comment: __Template_Cap)
C26  value 0.01UF  Voltage: 50V  [C0402]  (hidden comment: __Template_Cap)
C27  value 0.01UF  Voltage: 50V  [C0402]  (hidden comment: __Template_Cap)
C28  value 0.01UF  Voltage: 50V  [C0402]  (hidden comment: __Template_Cap)
C29  value 0.01UF  Voltage: 50V  [C0402]  (hidden comment: __Template_Cap)
C30  value 0.1UF  Voltage: 50V  [C0402]  (hidden comment: __Template_Cap)
C31  value 10uF  Voltage: 50V  [C1210_H2.7mm]  (hidden comment: __Template_Cap)
C32  value 10uF  Voltage: 50V  [C1210_H2.7mm]  (hidden comment: __Template_Cap)
C33  value 0.1UF  Voltage: 50V  [C0402]  (hidden comment: __Template_Cap)
C34  value 15uF  Voltage: 100V  [C2220]  (hidden comment: __Template_Cap)
C35  value 1UF  Voltage: 100V  [C0805]  (hidden comment: __Template_Cap_Auto)
C36  value 0.1UF  Voltage: 100V  [C0603]  (hidden comment: __Template_Cap_Auto)
C37  value 1UF  Voltage: 25V  [C0402]  (hidden comment: __Template_Cap)
D10  value DFLS1100-7  [POWERDI123_DFLS1100-7]  (hidden comment: __Template_Diode_Schottky_A/K)
L10  value 220 uH  [IND_MSS7348]  (hidden comment: __Template_Inductor)
R10  value 0.0015 OHM  Power: 3W  [R2512_H0.8MM]
R11  value 100  [R0402]
R13  value 100  [R0402]
R14  value 100  [R0402]
R15  value 100  [R0402]
R16  value 0  [R0402]
R17  value 1.3  [R0805]
R18  value 432K  [R0402]
R19  value 133K  [R0402]
R20  value 10K  [R0402]
R22  value 1.15K  [R0402]
R23  Mfg P/N: NCP15XH103F03RC  [R0402_H0.55MM]  (hidden comment: __Template_Thermistor)
TP10  TEST_KEYSTONE5015  [TP_KEYSTONE_5015]  (value not drawn)
U10  INA240A1D  [TI SOIC-8 D0008A]
U11  MFG P/N: DRV8353RSRGZT  [VQFN50P700X700X100-48-TP_TP-CUST_NO_VIAS]  (hidden comment: MOTOR_DRIVE_DRV8353RSRGZT)

### Blocks framed on the sheet
Motor Current Measurement & Bulk Decoupling: C10-C13 C15 C19-C21 C24 R10 R11 TP10 U10

### Sub-sheets
PHA = HBridge.SchDoc: GL (bidir), GH (bidir), PHASE (bidir), MPWR (in), VSL (out)
PHB = HBridge.SchDoc: GL (bidir), GH (bidir), PHASE (bidir), MPWR (in), VSL (out)
PHC = HBridge.SchDoc: GL (bidir), GH (bidir), PHASE (bidir), MPWR (in), VSL (out)

### Ports
3V3A (in), 24V0 (out), 24V0_SAFE (in), DRIVE_THERMISTOR (out), GD_FAULT_L (out), MOTOR_CURRENT_ADC (out), MPWR (out), MPWR_IN (in), PHASES_OUT (harness Phases), PWM (harness PWM), SPI (harness SPI), VDS_ADC (harness Phases)

### Harnesses
Phases: A, B, C
SPI: CLK, CS, MOSI, MISO
PWM: EN, PWM_HA, PWM_LA, PWM_HB, PWM_LB, PWM_HC, PWM_LC

### Nets
3V3A: C21.1 C30.1 U10.3(REF2) U10.6(VS) U11.26(VREF) ; port 3V3A
24V0: C31.1 C32.1 C33.1 R17.2 ; port 24V0
AGND: C21.2 C24.2 C27.2 C28.2 C29.2 C30.2 R23.2 U10.2(GND) U10.7(REF1) U11.27(AGND)
GND: C10.2 C11.2 C12.2 C13.2 C15.2 C16.2 C17.2 C19.2 C20.2 C23.2 C25.2 C31.2 C32.2 C33.2 C34.2 C35.2 C36.2 C37.2 D10.A R19.1 R22.1 U11.1(GND) U11.11(SPA) U11.14(SPB) U11.21(SPC) U11.41(DGND) U11.49(GND_TP)
MPWR: C10.1 C11.1 C12.1 C13.1 C15.1 C18.1 C19.1 C20.1 R10.2 U10.1(IN–) U11.6(VDRAIN) ; port MPWR, sheet PHA/MPWR, sheet PHB/MPWR, sheet PHC/MPWR
MPWR_IN: C34.1 C35.1 C36.1 R10.1 R18.1 U10.8(IN+) U11.43(VIN) ; port MPWR_IN
24V0_RIPPLE: L10.2 R17.1 R20.2
24V0_SAFE: C16.1 C17.1 U11.5(VM) ; port 24V0_SAFE
BST: C26.1 U11.45(BST)
FB: R20.1 R22.2 U11.48(FB)
GD_CLK: U11.31(SCLK) ; port SPI.CLK
GD_CPH: C22.1 U11.4(CPH)
GD_CPL: C22.2 U11.3(CPL)
GD_CS: U11.32(nSCS) ; port SPI.CS
GD_DVDD: C25.1 U11.40(DVDD)
GD_FAULT_L: U11.28(nFAULT) ; port GD_FAULT_L
GD_MISO: U11.29(SDO) ; port SPI.MISO
GD_MOSI: U11.30(SDI) ; port SPI.MOSI
GD_SOA: R15.2 U11.25(SOA)
GD_SOB: R14.2 U11.24(SOB)
GD_SOC: R13.2 U11.23(SOC)
GD_VCP: C18.2 U11.7(VCP)
GD_VGLS: C23.1 U11.2(VGLS)
GHA: U11.8(GHA) ; sheet PHA/GH
GHB: U11.17(GHB) ; sheet PHB/GH
GHC: U11.18(GHC) ; sheet PHC/GH
GLA: U11.10(GLA) ; sheet PHA/GL
GLB: U11.15(GLB) ; sheet PHB/GL
GLC: U11.20(GLC) ; sheet PHC/GL
MOTOR_CURRENT_ADC: C24.1 R11.2 TP10.1 ; port MOTOR_CURRENT_ADC
PHASEA: U11.9(SHA) ; sheet PHA/PHASE, port PHASES_OUT.A
PHASEB: U11.16(SHB) ; sheet PHB/PHASE, port PHASES_OUT.B
PHASEC: U11.19(SHC) ; sheet PHC/PHASE, port PHASES_OUT.C
PWM_EN: U11.33(ENABLE) ; port PWM.EN
PWM_HA: U11.34(INHA) ; port PWM.PWM_HA
PWM_HB: U11.36(INHB) ; port PWM.PWM_HB
PWM_HC: U11.38(INHC) ; port PWM.PWM_HC
PWM_LA: U11.35(INLA) ; port PWM.PWM_LA
PWM_LB: U11.37(INLB) ; port PWM.PWM_LB
PWM_LC: U11.39(INLC) ; port PWM.PWM_LC
RCL: R19.2 U11.46(RCL)
RTSD: R18.2 U11.47(RT/SD)
SNA: U11.12(SNA) ; sheet PHA/VSL
SNB: U11.13(SNB) ; sheet PHB/VSL
SNC: U11.22(SNC) ; sheet PHC/VSL
SW: D10.K L10.1 R16.2 U11.42(SW)
VCC: C37.1 U11.44(VCC)
VDS_A_ADC: C27.1 R15.1 ; port VDS_ADC.C
VDS_B_ADC: C28.1 R14.1 ; port VDS_ADC.B
VDS_C_ADC: C29.1 R13.1 ; port VDS_ADC.A
NetC26_2: C26.2 R16.1
NetJ5_19: R23.1 ; port DRIVE_THERMISTOR
NetR11_1: R11.1 U10.5(OUT)

Not connected (* = marked no-connect by the designer): U10 4(NC)*

### Layout directives
net class HVSW: BST, GD_CPH, GD_CPL, GD_VCP, NetC26_2, SW
net class HV: MPWR

### Notes on the sheet
- 11Vnom
- (near TP10) Fc = 15.9 kHz
- See Sheet 6, Feedback.SchDoc for more detail on INA240 design
- (near TP10) For bus current, we don't particularily care about phase lag, so we can put a more agressive filter on it.
- (near U11) Set current sense to MOSFET VDS Sense Mode
- Text
- (near U11) LM5008A
- ΔI @ 26V input = 19mA
- ΔI @ 60V input = 147mA
- Vpp, min = 19mA * 1.3 ohm = 24.5mV
- IoutMax = 310mA
- Fc = 159 kHz
- F = 444 kHz
- (near R19) Toff, CL@20V = 3.7 uS
- (near R22) Vout = 2.5 * (10k + 1.15k) / (1.15k) = 24.24V
- (near R23) Place near gate drive / FETs
- CREATIVE COMMONS
- PUBLIC LICENSE:
- BARKOUR ROBOT
- CC BY-NC 4.0
- APPROVED
- DWG NO
- GOOGLE LLC
- FILE
- RELEASED
- 2024/05/09
- SIZE
- 1600 AMPHITHEATRE PARKWAY
- MOUNTAIN VIEW CA 94043
- A3
- SHEET
- OF
- THIS DESIGN IS BEING PROVIDED  FOR NON-COMMERCIAL USE ONLY. THE USE OF =SCIENTIST_NAME_POSSESSIVE NAME IN CONNECTION WITH THE DESIGN IS NOT INTENDED TO IMPLY THAT =SCIENTIST_NAME SPONSORS OR ENDORSES THE DESIGN, GOOGLE LLC, OR ANY OF GOOGLE LLC'S PRODUCTS OR SERVICES.
- (in symbol 1039) A
- (in symbol 1093) A
- (in symbol 31291c97-b9eb-436f-b2ee-2be21f893d37) +

### Library data of the parts
C10 C11 = 31291c97-b9eb-436f-b2ee-2be21f893d37: WCAP-PTHR ALUMINUM POLYMER CAP; Manufacturer: Wurth Electronics; Grade: Commercial; Tolerance: 0.2; ComponentId: 31291c97-b9eb-436f-b2ee-2be21f893d37; Manufacturer Part Number: 870056175004; Package: Cap, Radial, Thru-Hole; ComponentLink1Description: Datasheet; ComponentLink1URL: https://katalog.we-online.de/pbs/datasheet/870056175004.pdf; Category: Polymer Capacitors; Status: Preliminary; Operating Temperature: -55 °C ~ 105 °C
C12 C13 C15 C19 C20 C34 = 207: CAP, CER, X7S, 15uF, 100V, 20%, 2220, 2.8mm T; ID: 207; MFG: TDK; MFG P/N: C5750X7S2A156M250KB; XPN: 150-00255-00; Status: Released; Package: 2220; Dielectric: X7S; Tolerance: 20%; Height: 2.8mm T; ComponentLink1Description: Datasheet; COMMON: 150-00255-00
C16 C36 = 1039: CAP, CER, X7S, 0.1uF, 100V, 10%, 0603, AUTOGRADE; ID: 1039; MFG: TDK; MFG P/N: CGA3E3X7S2A104K080AB; Dielectric: X7R; XPN: 150-00222-00; PROXY: 150-03755-00; Gecko: 150-04433-00; EES: 150-04577-00; Status: Released; Package: 0603; Tolerance: 10%; Height: 0.9mm T; ComponentLink1Description: Datasheet; COMMON: 150-00222-00; LOON: 150-00222-00
C17 C18 C35 = 1093: as C3 on sheet 1-Top; Status: Released; Package: 0805; Dielectric: X7S; Tolerance: 20%; Height: 1.5mm T; ComponentLink1Description: Datasheet; LOON: 150-01093-00; Gecko: 150-01093-00
C21 C24 C30 C33 = 1762: as C38 on sheet Feedback; Status: Released; Package: 0402; Dielectric: X5R; Tolerance: 10%; Height: 0.55mm; Supplier 1: Digi-Key; HelpURL: https://www.digikey.com/product-detail/en/yageo/CC0402KRX5R9BB104/311-3342-1-ND/6818312; ComponentLink1Description: Datasheet; ComponentLink1URL: http://www.yageo.com/documents/recent/UPY-GPHC_X5R_4V-to-50V_25.pdf; Supplier Part Number 1: 311-3342-1-ND
C22 = 1838: CAP, CER, X7R, 0.047uF, 100V, 10%, 0603, AUTOGRADE; ID: 1838; MFG: Samsung Electro-Mechanics; MFG P/N: CL10B473KC8WPNC; EES: 150-04561-00; Status: Released; Package: 0603; Dielectric: X7R; Tolerance: 10%; Height: 0.9mm; Supplier 1: Digi-Key; HelpURL: https://www.digikey.com/product-detail/en/samsung-electro-mechanics/CL10B473KC8WPNC/1276-6984-1-ND/7320626; ComponentLink1Description: Datasheet; ComponentLink1URL: https://www.samsungsem.com/resources/file/global/support/product_catalog/MLCC.pdf; Supplier Part Number 1: 1276-6984-1-ND
C23 C25 C37 = 1717: CAP, CER, X5R, 1uF, 10%, 25V, 0402; ID: 1717; MFG: TDK; MFG P/N: C1005X5R1E105K050BC; COMMON: 150-01202-00; PROXY: 150-03358-00; EES: 150-04580-00; Status: Released; Package: 0402; Dielectric: X5R; Tolerance: 10%; Height: 0.56mm; Supplier 1: Digi-Key; HelpURL: https://www.digikey.in/product-detail/en/tdk-corporation/C1005X5R1E105K050BC/445-9066-1-ND/3648637; ComponentLink1Description: Datasheet; ComponentLink1URL: https://product.tdk.com/info/en/catalog/datasheets/mlcc_commercial_general_en.pdf; Supplier Part Number 1: 445-9066-1-ND
C26-C29 = 625: as C5 on sheet 1-Top; Status: Released; Package: 0402; Dielectric: X7R; Tolerance: 20%; Height: 0.56mm T; ComponentLink1Description: Datasheet; COMMON: 150-00227-00; LOON: 150-00227-00; Gecko: 150-00227-00
C31 C32 = 1813: CAP, CER, X5R, 10uF, 50V, 20%, 1210; ID: 1813; MFG: TAIYO YUDEN; MFG P/N: UMK325BJ106MM-T; Gecko: 150-04488-00; EES: 150-04569-00; Status: Released; Package: 1210; Dielectric: X5R; Tolerance: 20%; Height: 2.7mm; Supplier 1: Digi-Key; HelpURL: https://www.digikey.com/product-detail/en/taiyo-yuden/UMK325BJ106MM-T/587-2225-1-ND/2002923; ComponentLink1Description: Datasheet; ComponentLink1URL: https://media.digikey.com/pdf/Data%20Sheets/Taiyo%20Yuden%20PDFs%20URL%20links/UMK325BJ106MM-T_Spec.pdf; Supplier Part Number 1: 587-2225-1-ND
D10 = 203: DIODE, SCHOTTKY, 100V, 1A, POWERDI123; ID: 203; MFG: Diodes Incorporated; Voltage – Forward (VF) (MAX) @ IF: 770mV @ 1A; Current - Reverse Leakage @ VR: 1µA @ 100V; PROXY: 480-01332-00; EES: 480-01752-00; Status: Released; MFG P/N: DFLS1100-7; Package: POWERDI®123; Category: Diode; RoHS Compliant: Yes; Diode Type: Schottky; Mounting Type: SMD; Voltage - DC Reverse (VR) (MAX): 100V; Current - Average Rectified (IO): 1A; Operating Temperature – Junction: -55°C ~ 175°C; Supplier 1: Digi-Key; HelpURL: https://www.digikey.in/product-detail/en/diodes-incorporated/DFLS1100-7/DFLS1100DICT-ND/765634?utm_adgroup=Semiconductor+Modules&mkwid=sEPp89yZo&pcrid=217293262460&pkw=&pmt=b&pdv=c&productid=&&gclid=EAIaIQobChMI07vviJLx3AIVWBiPCh384A5OEAAYAyAAEgIdtPD_BwE; ComponentLink1Description: Datasheet; ComponentLink1URL: https://www.diodes.com/assets/Datasheets/ds30497.pdf; Supplier Part Number 1: DFLS1100DICT-ND
L10 = 938: IND, WIREWOUND, SHIELDED, 220uH, 0.74A, 20%, DCR 0.624, SMD, AUTOGRADE; ID: 938; Catagory: Fixed Inductors; MFG: Coilcraft; MFG P/N: MSS7348-224ME_; Rdc max: 624 mOhms; Idc max: 740 mA; EES: 180-02231-00; ComponentLink1Description: Datasheet; Status: Released; Package: 2 - pin SMD; Tolerance: 20%; Supplier 1: Mouser; HelpURL: https://www.mouser.in/ProductDetail/Coilcraft/MSS7348-224MEB?qs=0gpYmj5HUPI60pjVHs4RmA%3D%3D; ComponentLink1URL: https://www.coilcraft.com/en-us/products/power/shielded-inductors/ferrite-drum/mss-mos/mss7348/#; Height: 4.8mm; Supplier Part Number 1: 994-MSS7348-224MEB
R10 = 9999: as R6 on sheet Feedback; Status: Released; Package: 2512; Tolerance: 1%; Height: 0.8mm; Supplier 1: Digi-Key; HelpURL: https://www.digikey.com/product-detail/en/te-connectivity-passive-product/TLR3A30DR0015FTDG/A131795CT-ND/8603925; ComponentLink1Description: Datasheet; ComponentLink1URL: https://www.te.com/commerce/DocumentDelivery/DDEController?Action=srchrtrv&DocNm=1773449-3&DocType=DS&DocLang=English; Supplier Part Number 1: A131795CT-ND
R11 R13-R15 = 7286: as R5 on sheet Feedback; Status: Released; Package: 0402; Power: 1/10W; Tolerance: 1%; XPN: 470-00294-00
R16 = 8004: RES, 0, JUMPER, 1/16W, 0402; ID: 8004; MFG: YAGEO; MFG P/N: RC0402FR-070RL; COMMON: 470-02332-00; PROXY: Use ID #2; Gecko: 470-17892-00; Status: Released; Package: 0402; Power: 1/16W; Tolerance: JUMPER; XPN: 470-02332-00
R17 = 8516: RES, 1.3, 1%, 1/2W, AUTOGRADE, 0805; ID: 8516; MFG: Panasonic Electronic Components; MFG P/N: ERJ-6DQF1R3V; Catagory: Resistor; Status: Released; Package: 0805; Power: 1/2W; Tolerance: 1%; Height: 0.70mm; Supplier 1: Digi-Key; HelpURL: https://www.digikey.in/product-detail/en/panasonic-electronic-components/ERJ-6DQF1R3V/P19271CT-ND/6004626; ComponentLink1Description: Datasheet; ComponentLink1URL: https://industrial.panasonic.com/cdbs/www-data/pdf/RDN0000/AOA0000C313.pdf; Supplier Part Number 1: P19271CT-ND
R18 = 8801: RES, 432K, 1%, 1/16W, 0402; ID: 8801; MFG: VISHAY; MFG P/N: CRCW0402432KFKED; PROXY: Use ID #9276; Status: Released; Package: 0402; Power: 1/16W; Tolerance: 1%; Height: 0.45mm; Supplier 1: Digi-Key; HelpURL: https://www.digikey.com/products/en?keywords=CRCW0402432KFKED; ComponentLink1Description: Datasheet; ComponentLink1URL: http://www.vishay.com/docs/28773/crcwce3.pdf
R19 = 5074: RES, 133K, 1%, 1/16W, 0402, AUTOGRADE; ID: 5074; MFG: VISHAY; MFG P/N: CRCW0402133KFKED; COMMON: 470-02579-00; PROXY: Use ID #9237; Gecko: 470-17712-00; XPN: XS-10013881; Orbital: 470-18085-00; Status: Released; Package: 0402; Power: 1/16W; Tolerance: 1%; Height: 0.40mm; Supplier 1: Digi-Key; Supplier Part Number 1: 541-133KLCT-ND
R20 = 7216: as R26 on sheet Feedback; Status: Released; Package: 0402; Power: 1/10W; Tolerance: 1%; XPN: 470-00319-00
R22 = 8684: RES, 1.15K, 1%, 1/16W, 0402; ID: 8684; MFG: VISHAY; MFG P/N: CRCW04021K15FKED; PROXY: Use ID #9098; Status: Released; Package: 0402; Power: 1/16W; Tolerance: 1%; Height: 0.45mm; Supplier 1: Digi-Key; HelpURL: https://www.digikey.com/products/en?keywords=CRCW04021K15FKED; ComponentLink1Description: Datasheet; ComponentLink1URL: http://www.vishay.com/docs/28773/crcwce3.pdf
R23 = 175: SENSOR, THERMISTOR, NTC, 10K, 1%, 3380K, 100mW, 0402; ID: 175; Mfg: Murata Electronics; SENSOR TYPE: THERMISTOR NTC; EES: 550-00601-00; Status: Released; Package: 0402; Category: Sensors; RoHS Compliant: Yes; Mounting Type: Surface Mount; Supplier 1: Digi-Key; HEIGHT (MAX): 0.55mm; OPERATING TEMPERATURE: -40°C ~ 125°C; HelpURL: https://www.digikey.com/product-detail/en/murata-electronics/NCP15XH103F03RC/490-4801-1-ND/1644682; ComponentLink1Description: Datasheet; ComponentLink1URL: https://www.murata.com/en-us/api/pdfdownloadapi?cate=&partno=NCP15XH103F03RC; Height: 0.55mm; Supplier Part Number 1: 490-4801-1-ND
TP10 = TEST_KEYSTONE5015: as TP3 on sheet Feedback; Supplier 1: Digi-Key; RoHS: RoHS Compliant; Category: Test and Measurement; Stock 1: 1322985; Pricing 1: 1=0.44, 10=0.413, 50=0.301, 100=0.2891, 250=0.25964, 500=0.24784 (USD); Type: PC Test Point, Miniature; Terminal: 0.010" (0.25mm) Phosphor Bronze, Silver Plate; Mounting Type: Surface Mount; Material: Phosphor Bronze; Color: -; Packaging: Cut Tape (CT); ComponentLink1URL: http://mail.keyelco.com/ENG._DEPT/PDF%20CAT%20NO%20Drawings/5015.pdf; ComponentLink1Description: Datasheet; Supplier Part Number 1: 5015KCT-ND
U10 = INA240A1: as U1 on sheet Feedback; Manufacturer Part Number: INA240A1D; Supplier 1: Digi-Key; Supplier 2: Mouser; Supplier 3: Farnell; Supplier Part Number 1: 296-51172-1-ND; Supplier Part Number 2: 595-INA240A1D; Supplier Part Number 3: 3005359
U11 = 820: IC, MOTOR DRIVER, DRV8353, MULTIPHASE, BLDC, HALF BRIDGE, POWER MOSFET, 6V TO 95V VIN, VQFN-48; ID: 820; MFG: Texas Instruments; EES: 313-05801-00; Status: Released; Package: 48-VQFN (7x7); Category: Integrated Circuits (ICs); RoHS Compliant: Yes; Supplier 1: Digi-Key; HelpURL: https://www.digikey.in/product-detail/en/texas-instruments/DRV8353RSRGZT/296-50273-1-ND/9654095; ComponentLink1Description: Datasheet; ComponentLink1URL: https://www.ti.com/lit/ds/symlink/drv8350.pdf?HQS=TI-null-null-digikeymode-df-pf-null-wwe&ts=1593096373926; Mounting Type: SMD; Height: 1mm; Supplier Part Number 1: 296-50273-1-ND

## Sheet HBridge.SchDoc
size 420 x 297 mm; DocumentNumber: 3; SheetNumber: 3; SheetTotal: 6; PageSetup: Record=PageOptions|CenterHorizontal=True|CenterVertical=True|PrintScale=0.96|XCorrection=1.00|YCorrection=1.00|PrintKind=1|BorderSize=5000000|LeftOffset=0|BottomOffset=0|Orientation=2|PaperLength=4318|PaperWidth=2794|Scale=100|PaperSource=7|PrintQuality=600|MediaType=1|DitherType=10|PaperKind=11" x 17"|PrintScaleMode=1
Used 3 times, as channels driver/PHA, driver/PHB, driver/PHC. Parts and nets are listed once, with the designators drawn on the sheet.
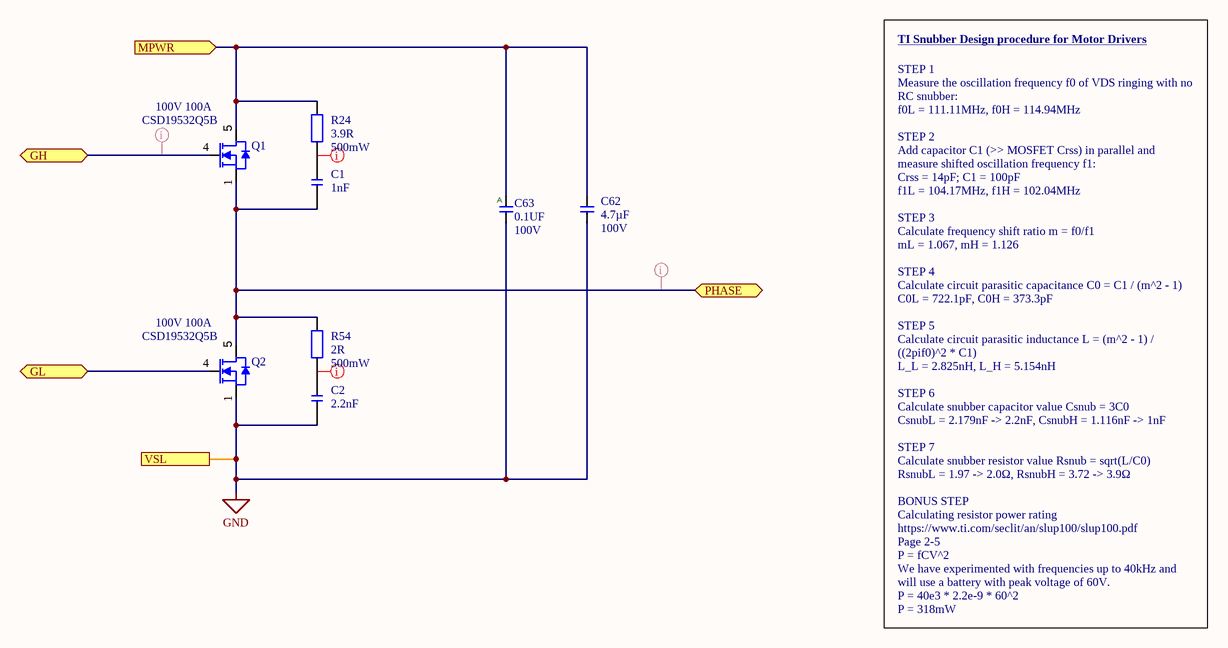
[diagram p3: HBridge.SchDoc]

### Parts
C1  1nF  [CAP 0603_1608 RF]
C2  2.2nF  [CAP 0603_1608 RF]
C62  Voltage - Rated: 100V  Capacitance: 4.7µF  [C1210]  (hidden comment: CAP_CER_1210_4.7UF_100V_20%_X7S)
C63  value 0.1UF  Voltage: 100V  [C0603]  (hidden comment: __Template_Cap_Auto)
NT1  Mechanical Feature NET_TIE_10MIL  [NETTIE_10MIL]  (value not drawn)  (net tie, no BOM)
Q1  value 100V 100A  Manufacturer Part Number: CSD19532Q5B  [TI_SON5X6]  (hidden comment: TI CSD19532Q5B)
Q2  value 100V 100A  Manufacturer Part Number: CSD19532Q5B  [TI_SON5X6]  (hidden comment: TI CSD19532Q5B)
R24  3.9R  Power Rating: 500mW  [RES 0805_2012 RF]
R54  2R  Power Rating: 500mW  [RES 0805_2012 RF]

### Ports
GH (bidir), GL (bidir), MPWR (in), PHASE (bidir), VSL (out)

### Nets
GND: C2.1 C62.2 C63.2 NT1.2 Q2.1(S)
GH: Q1.4(G) ; port GH
GL: Q2.4(G) ; port GL
MPWR: C62.1 C63.1 Q1.5(D) R24.2 ; port MPWR
PHASE: C1.1 Q1.1(S) Q2.5(D) R54.2 ; port PHASE
VSL: NT1.1 ; port VSL
NetC1_2: C1.2 R24.1
NetC2_2: C2.2 R54.1

### Channels
driver/PHA: designators end in A; ports GH=GHA GL=GLA MPWR=MPWR PHASE=PHASEA VSL=SNA
driver/PHB: designators end in B; ports GH=GHB GL=GLB MPWR=MPWR PHASE=PHASEB VSL=SNB
driver/PHC: designators end in C; ports GH=GHC GL=GLC MPWR=MPWR PHASE=PHASEC VSL=SNC

### Layout directives
net class HVSW: GHA, PHASEA
net class HV: NetC1A_2, NetC2A_2

### Notes on the sheet
- TI Snubber Design procedure for Motor Drivers <https://e2e.ti.com/support/motor-drivers-group/motor-drivers/f/motor-drivers-forum/991693/faq-proper-rc-snubber-design-for-motor-drivers>
- STEP 1
  Measure the oscillation frequency f0 of VDS ringing with no RC snubber:
  f0L = 111.11MHz, f0H = 114.94MHz
  STEP 2
  Add capacitor C1 (>> MOSFET Crss) in parallel and measure shifted oscillation frequency f1:
  Crss = 14pF; C1 = 100pF
  f1L = 104.17MHz, f1H = 102.04MHz
  STEP 3
  Calculate frequency shift ratio m = f0/f1
  mL = 1.067, mH = 1.126
  STEP 4
  Calculate circuit parasitic capacitance C0 = C1 / (m^2 - 1)
  C0L = 722.1pF, C0H = 373.3pF
  STEP 5
  Calculate circuit parasitic inductance L = (m^2 - 1) / ((2pif0)^2 * C1)
  L_L = 2.825nH, L_H = 5.154nH
  STEP 6
  Calculate snubber capacitor value Csnub = 3C0
  CsnubL = 2.179nF -> 2.2nF, CsnubH = 1.116nF -> 1nF
  STEP 7
  Calculate snubber resistor value Rsnub = sqrt(L/C0)
  RsnubL = 1.97 -> 2.0Ω, RsnubH = 3.72 -> 3.9Ω
  BONUS STEP
  Calculating resistor power rating
  https://www.ti.com/seclit/an/slup100/slup100.pdf
  Page 2-5
  P = fCV^2
  We have experimented with frequencies up to 40kHz and will use a battery with peak voltage of 60V.
  P = 40e3 * 2.2e-9 * 60^2
  P = 318mW
- CREATIVE COMMONS
- PUBLIC LICENSE:
- BARKOUR ROBOT
- CC BY-NC 4.0
- APPROVED
- DWG NO
- GOOGLE LLC
- FILE
- RELEASED
- 2024/05/09
- SIZE
- 1600 AMPHITHEATRE PARKWAY
- MOUNTAIN VIEW CA 94043
- A3
- SHEET
- OF
- THIS DESIGN IS BEING PROVIDED  FOR NON-COMMERCIAL USE ONLY. THE USE OF =SCIENTIST_NAME_POSSESSIVE NAME IN CONNECTION WITH THE DESIGN IS NOT INTENDED TO IMPLY THAT =SCIENTIST_NAME SPONSORS OR ENDORSES THE DESIGN, GOOGLE LLC, OR ANY OF GOOGLE LLC'S PRODUCTS OR SERVICES.
- (in symbol 1039) A

### Library data of the parts
C1 = C: Automotive grade SMD 0603 capacitor such as Vishay GA....31G series. 1nF 0603 10% X7R 100V; Tolerance: 10%; Temperature Coefficient: X7R; Voltage Rating: 100V; Capacitance: 1nF; Size Code: 0603
C2 = C: Automotive grade SMD 0603 capacitor such as Vishay GA....31G series. 2.2nF 0603 10% X7R 100V; Tolerance: 10%; Temperature Coefficient: X7R; Voltage Rating: 100V; Capacitance: 2.2nF; Size Code: 0603
C62 = CAP_CER_1210_4.7UF_100V_20%_X7S: CAP CER 4.7UF 100V X7S 1210; Manufacturer: TDK Corporation; Manufacturer Part Number: C3225X7S2A475M200AB; Part Number: 150-01016-00; Tolerance: ±20%; Supplier 1: Digi-Key; Supplier Part Number 1: 445-6043-1-ND; RoHS: RoHS Compliant; Category: Capacitors; Stock 1: 146032; Pricing 1: 1=1.4, 10=1.148, 100=0.812, 250=0.672, 500=0.602 (USD); Packaging: Cut Tape (CT); Temperature Coefficient: X7S; Mounting Type: Surface Mount, MLCC; Operating Temperature: -55°C ~ 125°C; Applications: General Purpose; Ratings: -; Package / Case: 1210 (3225 Metric); Size / Dimension: 0.126" L x 0.098" W (3.20mm x 2.50mm); Height - Seated (Max): -; Thickness (Max): 0.087" (2.20mm); Lead Spacing: -; Features: -; Lead Style: -; ComponentLink1URL: http://product.tdk.com/en/catalog/datasheets/mlcc_commercial_midvoltage_en.pdf; ComponentLink1Description: http://product.tdk.com/en/catalog/datasheets/mlcc_commercial_midvoltage_en.pdf
C63 = 1039: as C16 on sheet Drive; Status: Released; Package: 0603; Tolerance: 10%; Height: 0.9mm T; ComponentLink1Description: Datasheet; COMMON: 150-00222-00; LOON: 150-00222-00
NT1 = 5ac3c692-7d27-4cd1-ace3-d4aa111a5a9d: Net Tie, 10mil trace; ComponentId: 5ac3c692-7d27-4cd1-ace3-d4aa111a5a9d; Manufacturer: Mechanical; Manufacturer Part Number: NET_TIE_10MIL; Package: Net Tie, 10mil trace; ComponentLink1Description: Datasheet; Category: Mechanical Parts; Status: Preliminary
Q1 Q2 = be020311-d2d7-4d79-a360-c856c6f37d83: MOSFET N-CH 100V 100A 8SON; Part Number: 480-00437-00; Manufacturer: Texas Instruments; Grade: Commercial; Power Rating: 195W; ComponentId: be020311-d2d7-4d79-a360-c856c6f37d83; Package: 8-PowerTDFN SON5x6; ComponentLink1Description: Datasheet; ComponentLink1URL: http://www.ti.com/lit/ds/symlink/csd19532q5b.pdf; Category: N-Channel MOSFETs; Max Height: 1.05mm; Status: Preliminary; Current Rating: 100A; Voltage Rating: 100V; Storage Temperature: -55 °C ~ 150 °C; Operating Temperature: -55 °C ~ 150 °C
R24 = R: High power thick film 0805 resistor such as Vishay CRCW-HP e3 series CRCW08053R90DKEAHP; Tolerance: 1%; Voltage Rating: 150V; Temperature Coefficient: 100ppm/°C; Size Code: 0805; Resistance: 3.9R
R54 = R: High power thick film 0805 resistor such as Vishay CRCW-HP e3 series CRCW08052R00DKEAHP; Tolerance: 1%; Voltage Rating: 150V; Temperature Coefficient: 100ppm/°C; Size Code: 0805; Resistance: 2R